# Altium project SmartChessBoard.PrjPcb
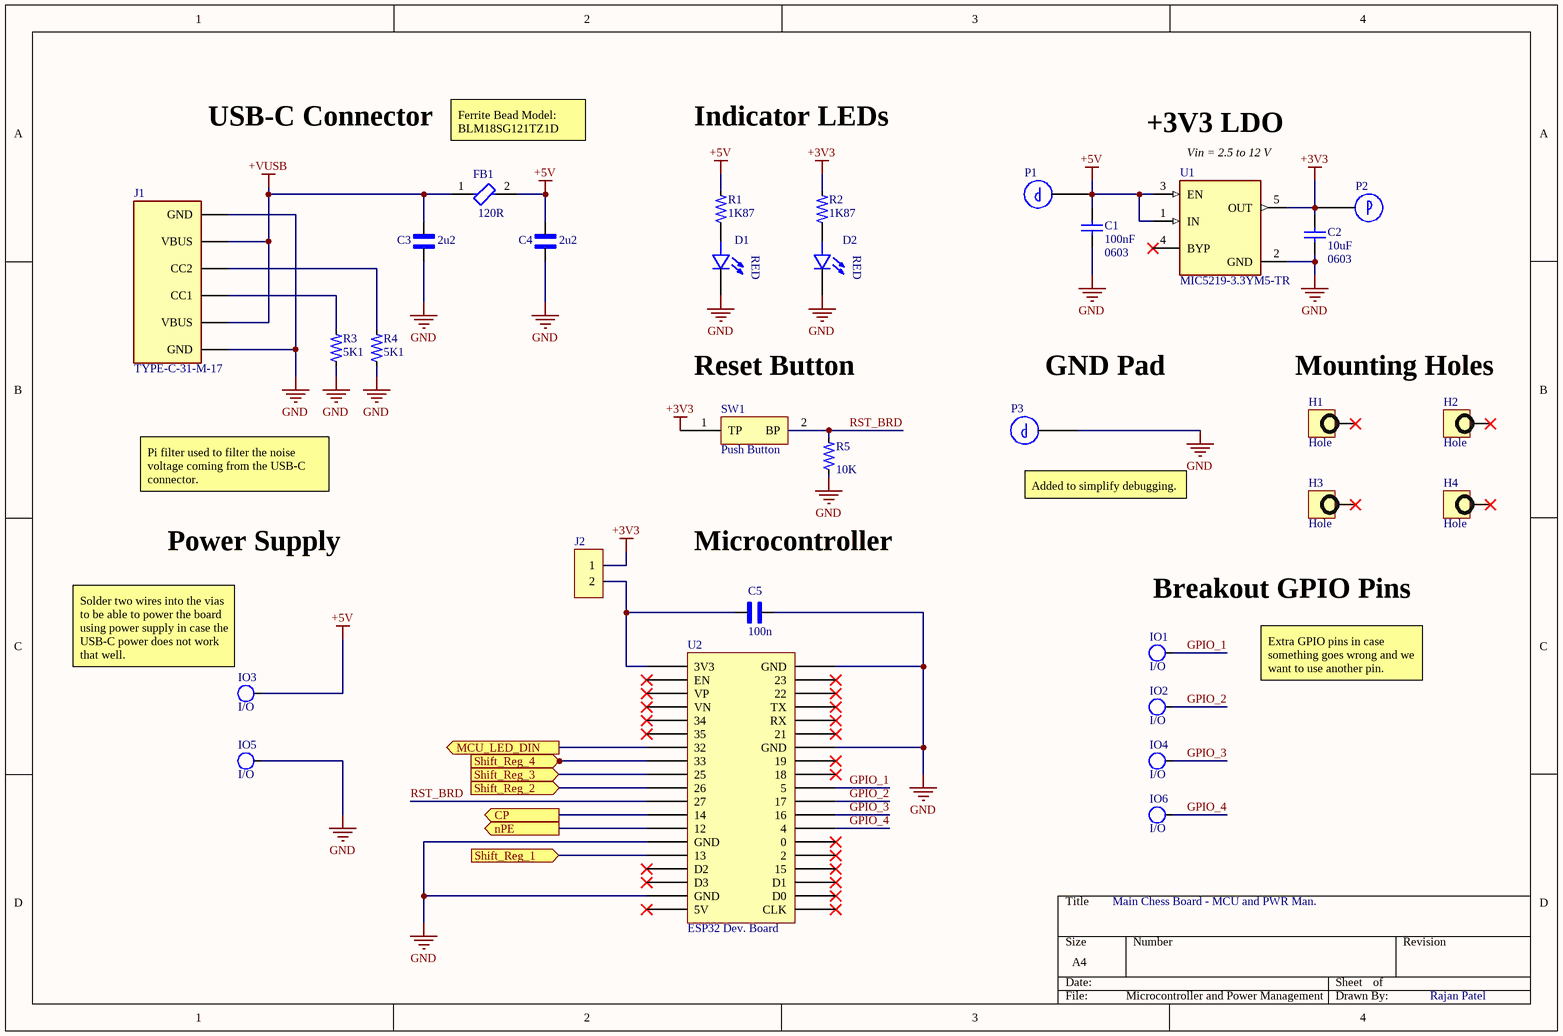
[diagram p0: Microcontroller and Power Management.SchDoc]
4 sheets, 305 parts. Net scope: flat (ports and power ports of the same name join across sheets).
Board file: Chess Board PCB.PcbDoc
Sheets:
  Microcontroller and Power Management.SchDoc
  Reed Switches.SchDoc
  WS2812B.SchDoc
  Shift Registers.SchDoc

## Sheet Microcontroller and Power Management.SchDoc
size A4; SheetNumber: 1; SheetTotal: 4

### Parts
C1  100nF  value 0603  [CAP 0805]
C2  10uF  value 0603  [CAP 0805]
C3  2u2  [CAP 0805]
C4  2u2  [CAP 0805]
C5  100n  [CAP 0805]
D1  LED 0805  [LED_0805]  (value not drawn)
D2  LED 0805  [LED_0805]  (value not drawn)
FB1  120R  [FP-BLM21-0_2-t0_85-e0_5-IPC_A]
H1  Hole  [M3 Holes]
H2  Hole  [M3 Holes]
H3  Hole  [M3 Holes]
H4  Hole  [M3 Holes]
IO1  I/O  [I/O]
IO2  I/O  [I/O]
IO3  I/O  [I/O]
IO4  I/O  [I/O]
IO5  I/O  [I/O]
IO6  I/O  [I/O]
J1  TYPE-C-31-M-17  [TYPEC31M17]
J2  2 Pin Male Header  [2 Pin Male Header]  (value not drawn)
P1  Probe_5019  [Testpoint]  (value not drawn)
P2  Probe_5019  [Testpoint]  (value not drawn)
P3  Probe_5019  [Testpoint]  (value not drawn)
R1  1K87  [res 0805]
R2  1K87  [res 0805]
R3  5K1  [res 0805]
R4  5K1  [res 0805]
R5  10K  [res 0805]
SW1  Push Button  [Push Button]
U1  MIC5219-3.3YM5-TR  [FP-SOT23-5LD-PL-1-IPC_C]
U2  ESP32 Dev. Board  [ESPRESSIF_ESP32-DEVKITC-32UE]

### Ports
CP (out, see Shift Registers[1A]), MCU_LED_DIN (out, see WS2812B[1B]), nPE (out, see Shift Registers[1A]), Shift_Reg_1 (in, see Shift Registers[2B]), Shift_Reg_2 (in, see Shift Registers[4B]), Shift_Reg_3 (in, see Shift Registers[2C]), Shift_Reg_4 (in, see Shift Registers[4C])

### Nets
+3V3: C2.2 J2.1 P2.1 R2.2 SW1.1(TP) U1.5(OUT)
+5V: C1.2 C4.2 FB1.2 IO3.1 P1.1 R1.2 U1.1(IN) U1.3(EN)
+VUSB: C3.2 FB1.1 J1.2(VBUS) J1.5(VBUS)
GND: C1.1 C2.1 C3.1 C4.1 C5.1 D1.1(C) D2.1(C) IO5.1 J1.1(GND) J1.6(GND) P3.1 R3.1 R4.1 R5.1 U1.2(GND) U2.14(GND) U2.18(GND) U2.32(GND) U2.38(GND)
CP: U2.12(14) ; port CP
GPIO_1: IO1.1 U2.29(5)
GPIO_2: IO2.1 U2.28(17)
GPIO_3: IO4.1 U2.27(16)
GPIO_4: IO6.1 U2.26(4)
nPE: U2.13(12) ; port nPE
RST_BRD: R5.2 SW1.2(BP) U2.11(27)
NetC5_2: C5.2 J2.2 U2.1(3V3)
NetD1_2: D1.2(A) R1.1
NetD2_2: D2.2(A) R2.1
NetJ1_3: J1.3(CC1) R3.2
NetJ1_4: J1.4(CC2) R4.2
NetU2_7: U2.7(32) ; port MCU_LED_DIN
NetU2_8: U2.8(33) ; port Shift_Reg_4
NetU2_9: U2.9(25) ; port Shift_Reg_3
NetU2_10: U2.10(26) ; port Shift_Reg_2
NetU2_15: U2.15(13) ; port Shift_Reg_1

Not connected (* = marked no-connect by the designer): H1 1(TERMINAL)*; H2 1(TERMINAL)*; H3 1(TERMINAL)*; H4 1(TERMINAL)*; U1 4(BYP)*; U2 2(EN)* 3(VP)* 4(VN)* 5(34)* 6(35)* 16(D2)* 17(D3)* 19(5V)* 20(CLK)* 21(D0)* 22(D1)* 23(15)* 24(2)* 25(0)* 30(18)* 31(19)* 33(21)* 34(RX)* 35(TX)* 36(22)* 37(23)*

### Notes on the sheet
- USB-C Connector
- Ferrite Bead Model: BLM18SG121TZ1D
- Indicator LEDs
- +3V3 LDO
- (near U1) Vin = 2.5 to 12 V
- Reset Button
- (near P3) GND Pad
- Mounting Holes
- Pi filter used to filter the noise voltage coming from the USB-C connector.
- (near P3) Added to simplify debugging.
- Power Supply
- Microcontroller
- Breakout GPIO Pins
- (near IO3) Solder two wires into the vias to be able to power the board using power supply in case the USB-C power does not work that well.
- Extra GPIO pins in case something goes wrong and we want to use another pin.
- Main Chess Board - MCU and PWR Man.
- Rajan Patel
- (in symbol LED 0805) RED

### Library data of the parts
C1 C2 = Cap: Capacitor; Published: 8-Jun-2000; LatestRevisionDate: 17-Jul-2002; LatestRevisionNote: Re-released for DXP Platform.; PackageReference: RAD-0.3; Publisher: Altium Limited; PackageDescription: Radial Cap, Thru-Hole; 2 Leads; 0.3 in Pin Spacing
C3-C5 = CAP 0805: SnapEDA_Link: https://www.snapeda.com/parts/C2012X8R1H104K125AA/TDK/view-part/?ref=snap; Check_prices: https://www.snapeda.com/parts/C2012X8R1H104K125AA/TDK/view-part/?ref=eda; Value: *
D1 D2 = LED 0805: Red LED Indication - Discrete 1.7V 0805 (2012 Metric); MP: 7012X1; Package: None; Availability: Unavailable; Value: *; Price: None
FB1 = CMP-0686-00716-3: FERRITE BEAD 120 OHM 0603 1LN; Number of Lines: 1; DC Resistance-Max: 100mR; Material: Steel; Max DC Current: 200mA; Shielding: Unshielded; Test Frequency: 100MHz; Current Rating: 800mA; Max Current Rating: 1A; Resistance: 150mR; Tolerance: 25%; Width: 1.25mm; Number of Circuits: 1; Military Standard: Not; Height: 0.85mm; Series: BLM21A; Min Operating Temperature: -55°C; DC Resistance (DCR): 100mR; Termination: SMD/SMT; Impedance: 120R; Core Material: Ferrite; REACH SVHC: No SVHC; Radiation Hardening: No; Max Operating Temperature: 125°C; Number of Pins: 2; Case/Package: 0805; Case Code (Imperial): 0805; Frequency: 100MHz; Depth: 1.25mm; Length: 2mm; DC Current: 200mA; Lead Free: Lead Free; Case Code (Metric): 2012; Package Quantity: 1; Packaging: Tape and Reel
J1 = TYPE-C-31-M-17: TYPE-C-31-M-17 HROPARTS; MF: HRO Electronics Co., Ltd.; SnapEDA_Link: https://www.snapeda.com/parts/TYPE-C-31-M-17/HRO+Electronics+Co.%252C+Ltd./view-part/?ref=snap; Package: Package; Value: *; MP: TYPE-C-31-M-17; Check_prices: https://www.snapeda.com/parts/TYPE-C-31-M-17/HRO+Electronics+Co.%252C+Ltd./view-part/?ref=eda
J2 = 2 Pin Male Header: Board Connector, 2 Contact(s), 1 Row(s), Male, Straight, 0.1 inch Pitch, Solder Terminal, Black Insulator, Receptacle; Manufacturer: TE Connectivity; Manufacturer Part Number: 5-146277-2; Option: General Purpose; Contact Pattern: RECTANGULAR; Contact Style: SQ PIN-SKT; Filter Feature: No; Number Of Connectors: 1; Number of Contacts: 2; Body Breadth: 0.092inch; Body Depth: 0.09inch; Body Length: 0.184inch; Plating Thickness: 30uin; Reference Standard: UL; Reliability: COMMERCIAL; Supplier: Digikey; Supplier Part Number: A121371-ND; RoHS: Yes; Category: Connectors; Stock: 17660; Pricing: 1=0.41, 10=0.372, 100=0.3099, 500=0.2634, 1000=0.23087, 5000=0.20608, 10000=0.19176 (USD); Mounting Technology: Board; Contact Finish - Mating: MATTE TIN; Contact Finish - Termination: MATTE TIN; Insulation Color: Black; Insulation Material: Polymer; Connector Type: BOARD CONNECTOR; JESD-609 Code: e3; Body/Shell Style: RECEPTACLE; Contact Gender: Male; Mixed Contacts: No; Mounting Style: STRAIGHT; Number Of PCB Rows: 1; Number of Rows Loaded: 1; PCB Contact Pattern: RECTANGULAR; Termination: Solder; Mating Contact Pitch: 0.1inch; Terminal Length: 0.125inch; Terminal Pitch: 2.54mm; DIN Conformance: No; IEC Conformance: No; MIL Conformance: No; Reach SVHC Compliant: Yes; RoHS Compliant: Yes; ComponentLink1URL: https://datasheet.ciiva.com:443/pdfs/VipMasterIC/IC/TYEL/TYEL-L-A0003497673/TYEL-S-A0000657051-1.pdf?src-supplier=IHS+Markit; ComponentLink1Description: https://datasheet.ciiva.com:443/pdfs/VipMasterIC/IC/TYEL/TYEL-L-A0003497673/TYEL-S-A0000657051-1.pdf?src-supplier=IHS+Markit; ComponentLink2URL: https://datasheet.ciiva.com/22660/1537112-22660377.pdf?src-supplier=Element14; ComponentLink2Description: https://datasheet.ciiva.com/22660/1537112-22660377.pdf?src-supplier=Element14; ComponentLink3URL: https://datasheet.ciiva.com/717/eng-cd-146277-h-146277-1-c-dwg-717333.pdf?src-supplier=Digikey; ComponentLink3Description: https://datasheet.ciiva.com/717/eng-cd-146277-h-146277-1-c-dwg-717333.pdf?src-supplier=Digikey; ComponentLink4URL: https://datasheet.ciiva.com/16426/eng-cd-146277-g2-16426389.pdf?src-supplier=Future+Electronics; ComponentLink4Description: https://datasheet.ciiva.com/16426/eng-cd-146277-g2-16426389.pdf?src-supplier=Future+Electronics; ComponentLink5URL: https://datasheet.ciiva.com/30096/146277-30096236.pdf?src-supplier=Onlinecomponents.com; ComponentLink5Description: https://datasheet.ciiva.com/30096/146277-30096236.pdf?src-supplier=Onlinecomponents.com
P1-P3 = Probe_5019: Phosphor Bronze Contact Miniature Silver Plated Surface Mount Test Points; Manufacturer: Keystone Electronics; Manufacturer Part Number: 5019; Supplier 1: Newark; RoHS: Yes; Category: Connectors; Stock 1: 148000; Pricing 1: 1=0.12300, 1000=0.12300, 2000=0.11700, 4000=0.11300, 6000=0.11000 (USD); Mount: Surface Mount,PCB; Number of Pins: 1; Contact Plating: Silver; Contact Material: Bronze; Material: Bronze; Plating: Silver; Body Material: Bronze; Packaging: Tape and Reel; Package Quantity: 1; Termination: SMD/SMT; Series: 5019; Height: 0.09inch; RoHS Compliant: Yes; Lead Free: Lead Free; Reach SVHC Compliant: Yes; ComponentLink1URL: https://datasheet.ciiva.com/16318/m60-2p61-16318395.pdf?src-supplier=Future+Electronics; ComponentLink1Description: https://datasheet.ciiva.com/16318/m60-2p61-16318395.pdf?src-supplier=Future+Electronics; ComponentLink2URL: https://datasheet.ciiva.com/16885/70182998-16885945.pdf?src-supplier=Allied+Electronics; ComponentLink2Description: https://datasheet.ciiva.com/16885/70182998-16885945.pdf?src-supplier=Allied+Electronics; ComponentLink3URL: https://datasheet.ciiva.com/14848/m60-2p61-14848437.pdf?src-supplier=Digi-Key; ComponentLink3Description: https://datasheet.ciiva.com/14848/m60-2p61-14848437.pdf?src-supplier=Digi-Key; ComponentLink4URL: https://datasheet.ciiva.com/14848/m60-2p61-14848438.pdf?src-supplier=Digi-Key; ComponentLink4Description: https://datasheet.ciiva.com/14848/m60-2p61-14848438.pdf?src-supplier=Digi-Key; ComponentLink5URL: https://datasheet.ciiva.com/14848/m60-2p61-14848439.pdf?src-supplier=Digi-Key; ComponentLink5Description: https://datasheet.ciiva.com/14848/m60-2p61-14848439.pdf?src-supplier=Digi-Key; Supplier Part Number 1: 06W4636
R1-R5 = Resistor 0805: MP: 2-2176053-2; Resistance: .39; Power_Rating: .25 W; MF: TE Connectivity; Tolerance: 1%; Package: 0805; Value: *; SnapEDA_Link: https://www.snapeda.com/parts/2-2176053-2/TE%20Connectivity/view-part/2214511/?ref=snap; Availability: Unavailable; Price: None; EU_RoHS_Compliance: Compliant with Exemptions
U1 = CMP-06324-000027-1: IC REG LINEAR 3.3V 500MA SOT23-5; Dropout Voltage: 350mV; Output Type: Fixed; Number of Regulators: 1; Max Input Voltage: 12V; Min Input Voltage: 2.5V; Min Operating Temperature: -40°C; Nominal Output Voltage: 3.3V; Output Voltage: 3.3V; Packaging: Cut Tape; Mount: Surface Mount; Number of Pins: 5; Case/Package: SOT-23-5; Lead Free: Lead Free; Max Operating Temperature: 125°C; REACH SVHC: No SVHC; Output Current: 500mA
U2 = ESP32 Dev. Board: ESP32-WROOM-32UE Series Evaluation Board 802.11 b/g/n (WiFi, WLAN) Bluetooth Smart Ready 4.x Dual Mode; Manufacturer: Espressif Systems; Manufacturer Part Number: ESP32-DEVKITC-32UE; Supplier: Digikey; Supplier Part Number: 1965-ESP32-DEVKITC-32UE-ND; RoHS: No; Category: RF Semiconductors and Devices; Stock: 498; Pricing: 1=10 (USD); ComponentLink1URL: https://www.espressif.com/sites/default/files/documentation/espressif_products_ordering_information_en.pdf?src-supplier=Digikey; ComponentLink1Description: https://www.espressif.com/sites/default/files/documentation/espressif_products_ordering_information_en.pdf?src-supplier=Digikey; ComponentLink2URL: https://datasheet.octopart.com/ESP32-DEVKITC-32UE-Espressif-Systems-datasheet-165560559.pdf?src-supplier=TME; ComponentLink2Description: https://datasheet.octopart.com/ESP32-DEVKITC-32UE-Espressif-Systems-datasheet-165560559.pdf?src-supplier=TME

## Sheet Reed Switches.SchDoc
size A2; SheetNumber: 2; SheetTotal: 4
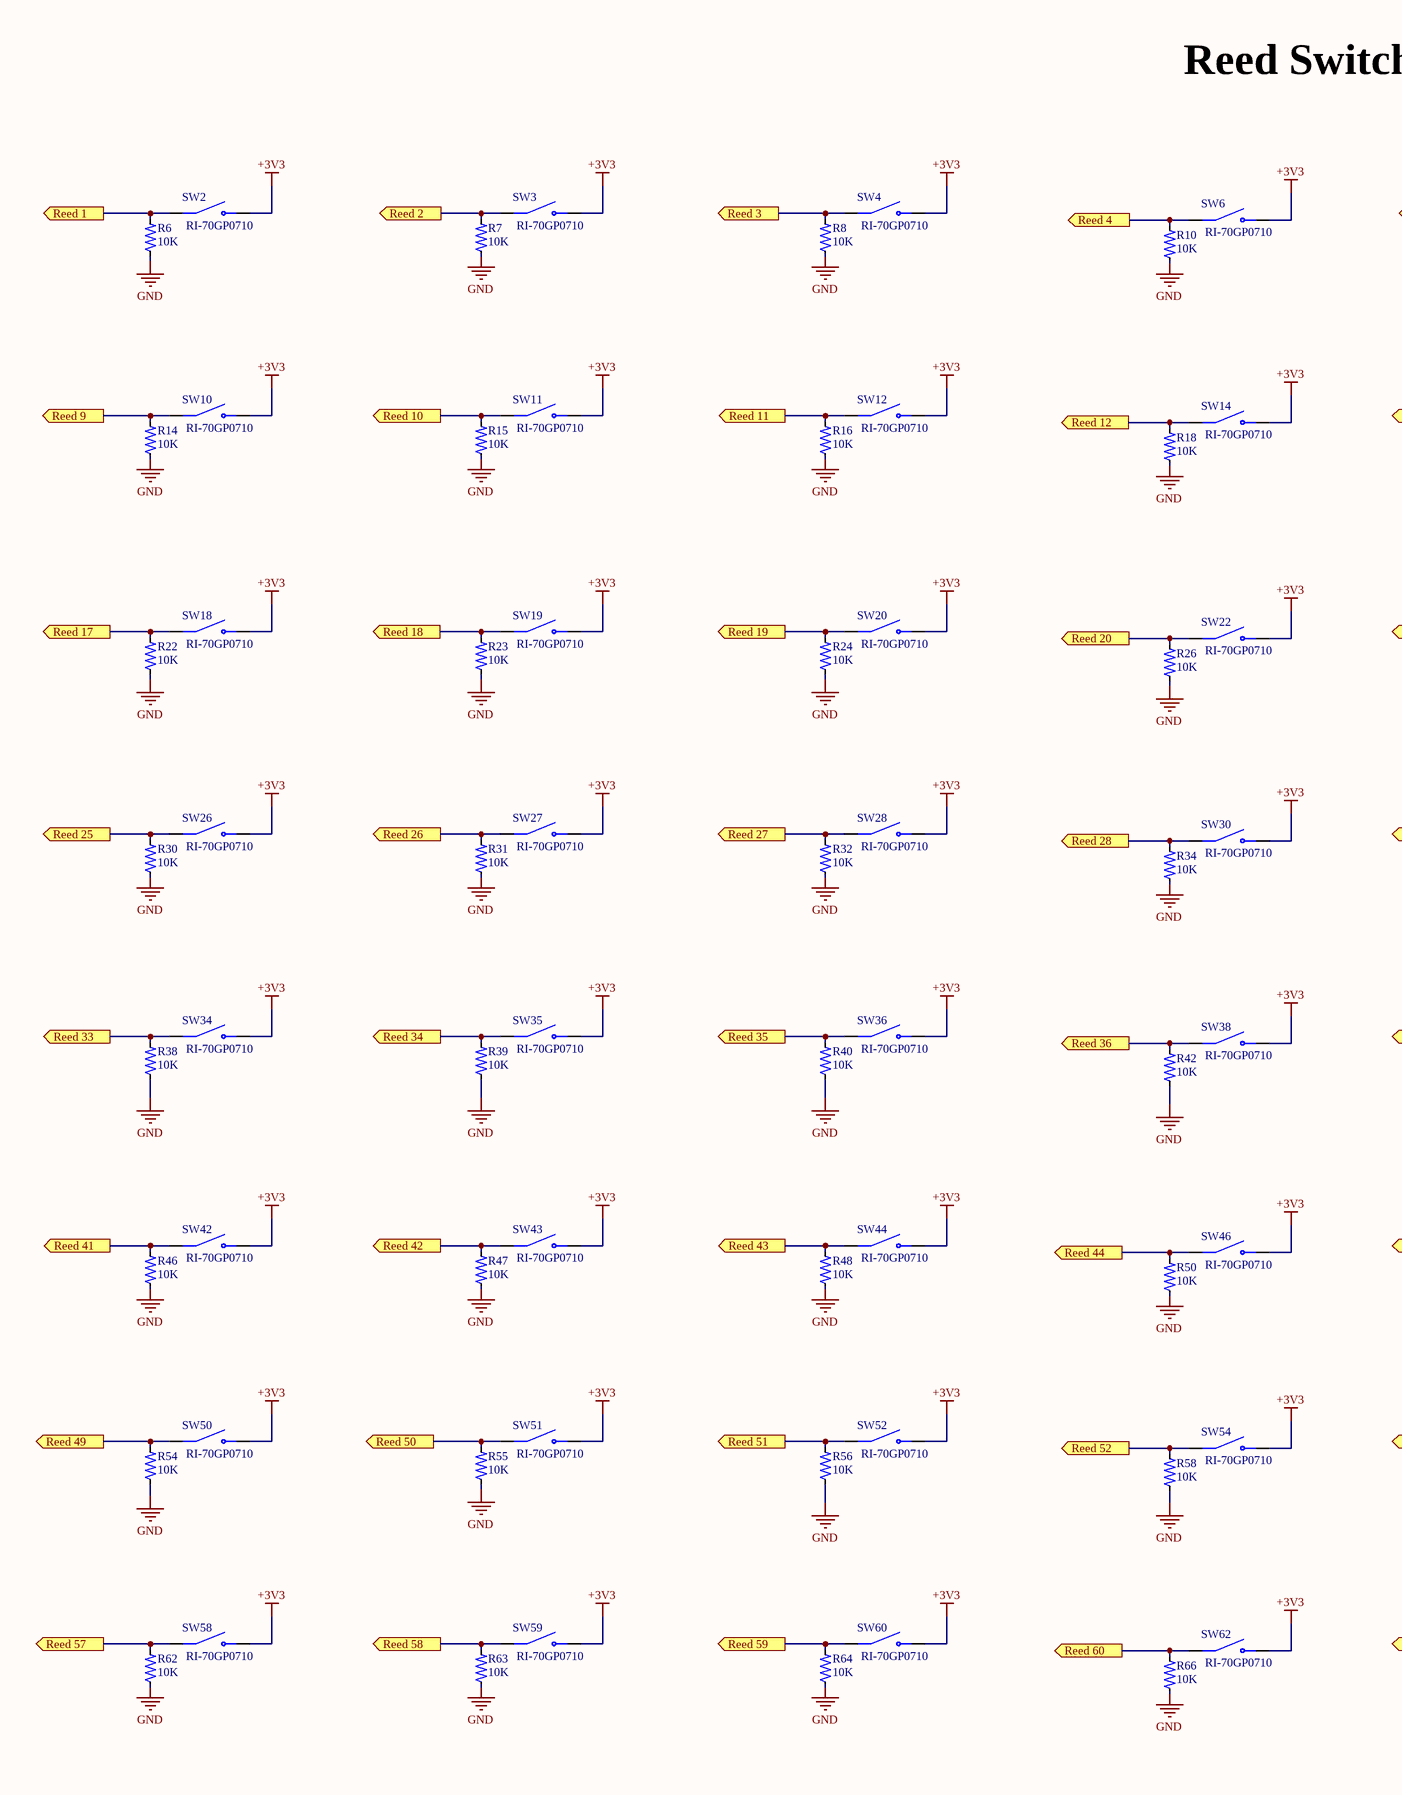
[diagram p1: Reed Switches.SchDoc, left]
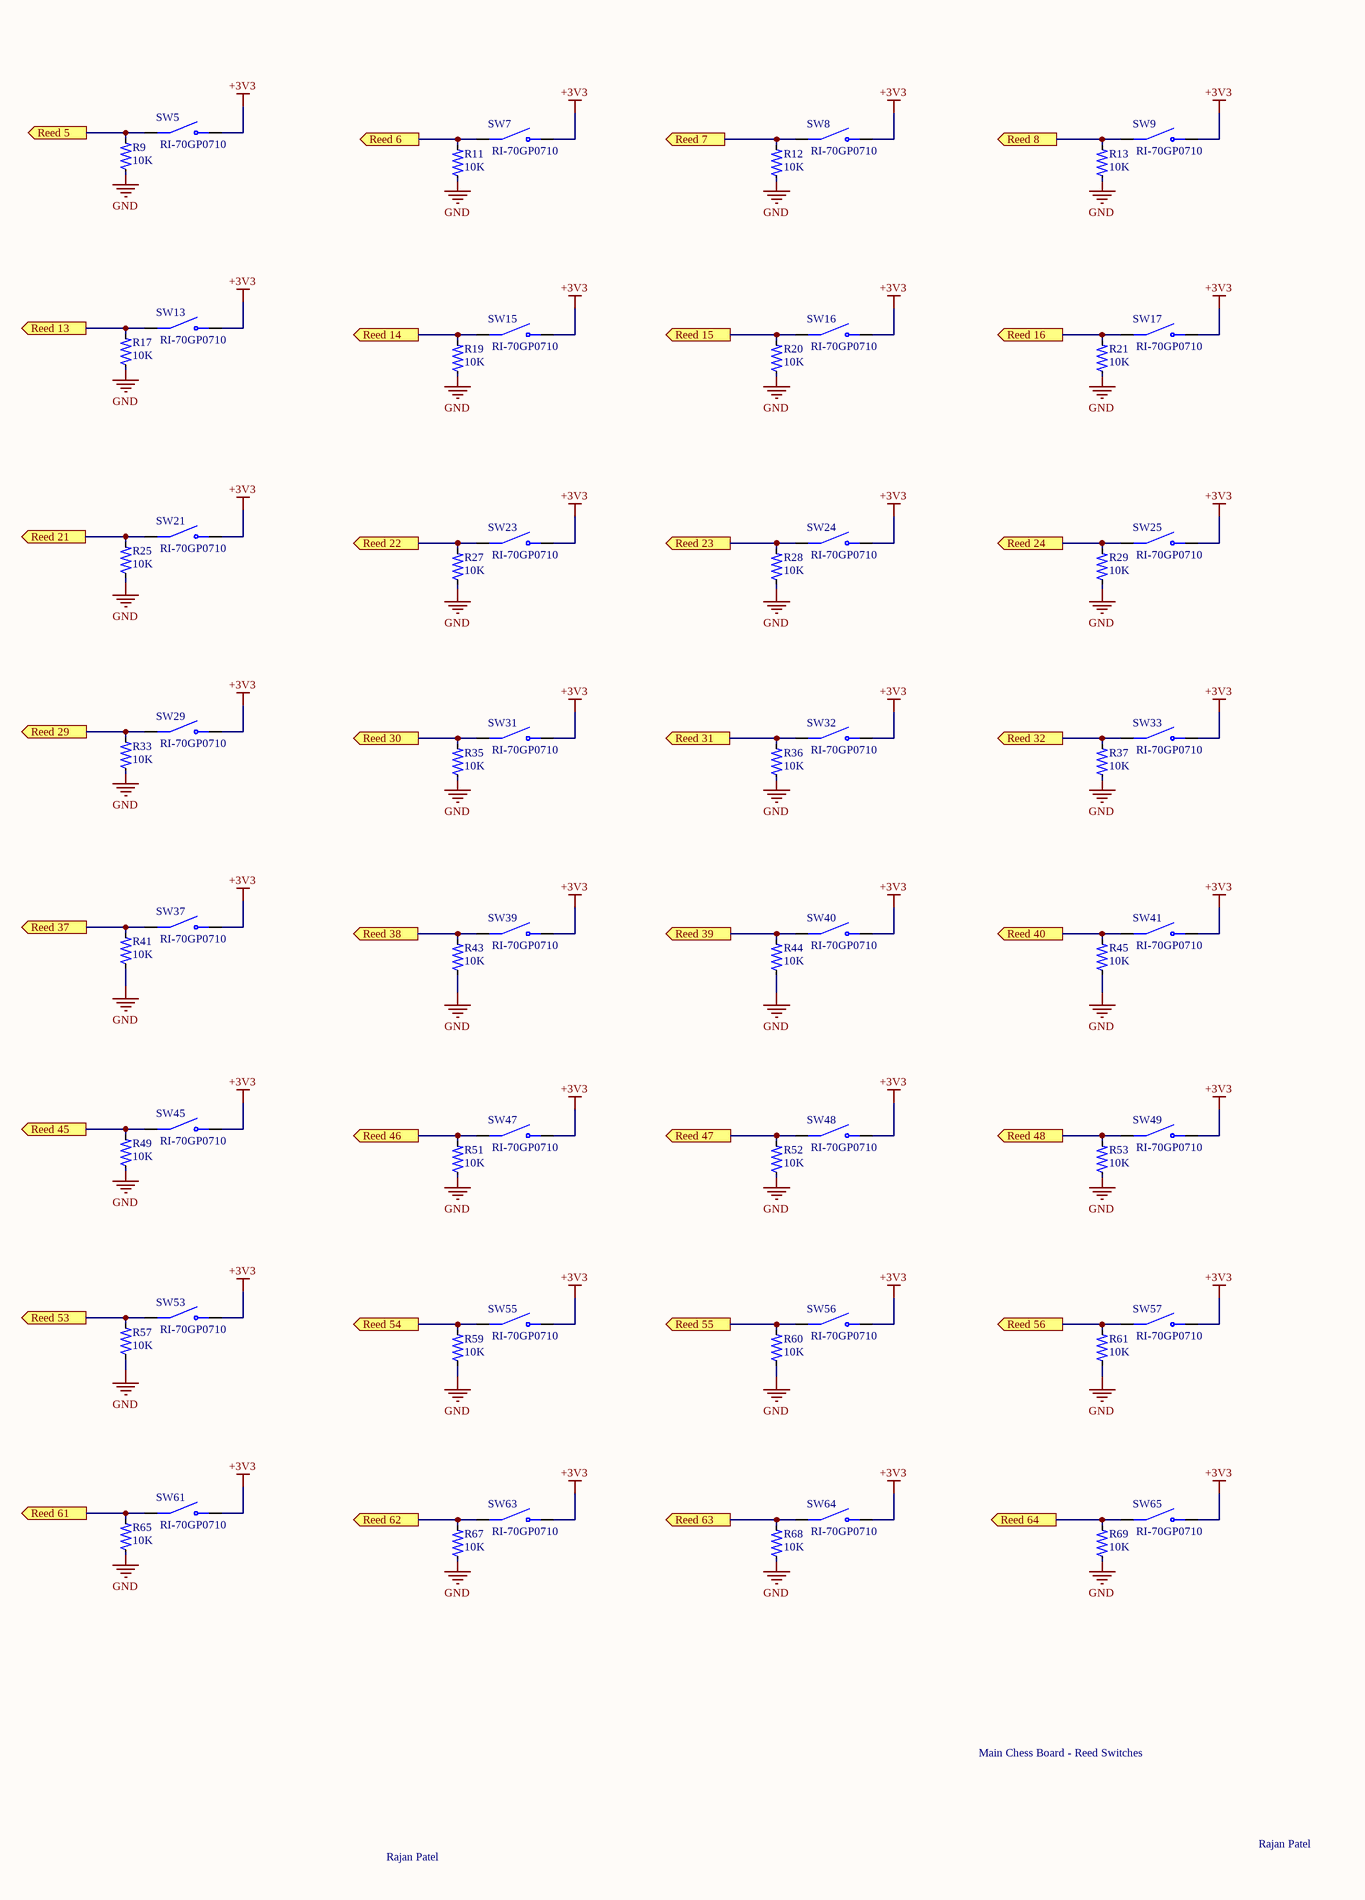
[diagram p2: Reed Switches.SchDoc, right]

### Parts
R6  10K  [res 0805]
R7  10K  [res 0805]
R8  10K  [res 0805]
R9  10K  [res 0805]
R10  10K  [res 0805]
R11  10K  [res 0805]
R12  10K  [res 0805]
R13  10K  [res 0805]
R14  10K  [res 0805]
R15  10K  [res 0805]
R16  10K  [res 0805]
R17  10K  [res 0805]
R18  10K  [res 0805]
R19  10K  [res 0805]
R20  10K  [res 0805]
R21  10K  [res 0805]
R22  10K  [res 0805]
R23  10K  [res 0805]
R24  10K  [res 0805]
R25  10K  [res 0805]
R26  10K  [res 0805]
R27  10K  [res 0805]
R28  10K  [res 0805]
R29  10K  [res 0805]
R30  10K  [res 0805]
R31  10K  [res 0805]
R32  10K  [res 0805]
R33  10K  [res 0805]
R34  10K  [res 0805]
R35  10K  [res 0805]
R36  10K  [res 0805]
R37  10K  [res 0805]
R38  10K  [res 0805]
R39  10K  [res 0805]
R40  10K  [res 0805]
R41  10K  [res 0805]
R42  10K  [res 0805]
R43  10K  [res 0805]
R44  10K  [res 0805]
R45  10K  [res 0805]
R46  10K  [res 0805]
R47  10K  [res 0805]
R48  10K  [res 0805]
R49  10K  [res 0805]
R50  10K  [res 0805]
R51  10K  [res 0805]
R52  10K  [res 0805]
R53  10K  [res 0805]
R54  10K  [res 0805]
R55  10K  [res 0805]
R56  10K  [res 0805]
R57  10K  [res 0805]
R58  10K  [res 0805]
R59  10K  [res 0805]
R60  10K  [res 0805]
R61  10K  [res 0805]
R62  10K  [res 0805]
R63  10K  [res 0805]
R64  10K  [res 0805]
R65  10K  [res 0805]
R66  10K  [res 0805]
R67  10K  [res 0805]
R68  10K  [res 0805]
R69  10K  [res 0805]
SW2  RI-70GP0710  [RI-70GP0710]
SW3  RI-70GP0710  [RI-70GP0710]
SW4  RI-70GP0710  [RI-70GP0710]
SW5  RI-70GP0710  [RI-70GP0710]
SW6  RI-70GP0710  [RI-70GP0710]
SW7  RI-70GP0710  [RI-70GP0710]
SW8  RI-70GP0710  [RI-70GP0710]
SW9  RI-70GP0710  [RI-70GP0710]
SW10  RI-70GP0710  [RI-70GP0710]
SW11  RI-70GP0710  [RI-70GP0710]
SW12  RI-70GP0710  [RI-70GP0710]
SW13  RI-70GP0710  [RI-70GP0710]
SW14  RI-70GP0710  [RI-70GP0710]
SW15  RI-70GP0710  [RI-70GP0710]
SW16  RI-70GP0710  [RI-70GP0710]
SW17  RI-70GP0710  [RI-70GP0710]
SW18  RI-70GP0710  [RI-70GP0710]
SW19  RI-70GP0710  [RI-70GP0710]
SW20  RI-70GP0710  [RI-70GP0710]
SW21  RI-70GP0710  [RI-70GP0710]
SW22  RI-70GP0710  [RI-70GP0710]
SW23  RI-70GP0710  [RI-70GP0710]
SW24  RI-70GP0710  [RI-70GP0710]
SW25  RI-70GP0710  [RI-70GP0710]
SW26  RI-70GP0710  [RI-70GP0710]
SW27  RI-70GP0710  [RI-70GP0710]
SW28  RI-70GP0710  [RI-70GP0710]
SW29  RI-70GP0710  [RI-70GP0710]
SW30  RI-70GP0710  [RI-70GP0710]
SW31  RI-70GP0710  [RI-70GP0710]
SW32  RI-70GP0710  [RI-70GP0710]
SW33  RI-70GP0710  [RI-70GP0710]
SW34  RI-70GP0710  [RI-70GP0710]
SW35  RI-70GP0710  [RI-70GP0710]
SW36  RI-70GP0710  [RI-70GP0710]
SW37  RI-70GP0710  [RI-70GP0710]
SW38  RI-70GP0710  [RI-70GP0710]
SW39  RI-70GP0710  [RI-70GP0710]
SW40  RI-70GP0710  [RI-70GP0710]
SW41  RI-70GP0710  [RI-70GP0710]
SW42  RI-70GP0710  [RI-70GP0710]
SW43  RI-70GP0710  [RI-70GP0710]
SW44  RI-70GP0710  [RI-70GP0710]
SW45  RI-70GP0710  [RI-70GP0710]
SW46  RI-70GP0710  [RI-70GP0710]
SW47  RI-70GP0710  [RI-70GP0710]
SW48  RI-70GP0710  [RI-70GP0710]
SW49  RI-70GP0710  [RI-70GP0710]
SW50  RI-70GP0710  [RI-70GP0710]
SW51  RI-70GP0710  [RI-70GP0710]
SW52  RI-70GP0710  [RI-70GP0710]
SW53  RI-70GP0710  [RI-70GP0710]
SW54  RI-70GP0710  [RI-70GP0710]
SW55  RI-70GP0710  [RI-70GP0710]
SW56  RI-70GP0710  [RI-70GP0710]
SW57  RI-70GP0710  [RI-70GP0710]
SW58  RI-70GP0710  [RI-70GP0710]
SW59  RI-70GP0710  [RI-70GP0710]
SW60  RI-70GP0710  [RI-70GP0710]
SW61  RI-70GP0710  [RI-70GP0710]
SW62  RI-70GP0710  [RI-70GP0710]
SW63  RI-70GP0710  [RI-70GP0710]
SW64  RI-70GP0710  [RI-70GP0710]
SW65  RI-70GP0710  [RI-70GP0710]

### Ports
Reed 1 (out, see Shift Registers[2B]), Reed 2 (out, see Shift Registers[2B]), Reed 3 (out, see Shift Registers[2B]), Reed 4 (out, see Shift Registers[2B]), Reed 5 (out, see Shift Registers[2B]), Reed 6 (out, see Shift Registers[2B]), Reed 7 (out, see Shift Registers[2B]), Reed 8 (out, see Shift Registers[2B]), Reed 9 (out, see Shift Registers[1B]), Reed 10 (out, see Shift Registers[1B]), Reed 11 (out, see Shift Registers[1B]), Reed 12 (out, see Shift Registers[1B]), Reed 13 (out, see Shift Registers[1B]), Reed 14 (out, see Shift Registers[1B]), Reed 15 (out, see Shift Registers[1B]), Reed 16 (out, see Shift Registers[1B]), Reed 17 (out, see Shift Registers[4B]), Reed 18 (out, see Shift Registers[4B]), Reed 19 (out, see Shift Registers[4B]), Reed 20 (out, see Shift Registers[4B]), Reed 21 (out, see Shift Registers[4B]), Reed 22 (out, see Shift Registers[4B]), Reed 23 (out, see Shift Registers[4B]), Reed 24 (out, see Shift Registers[4B]), Reed 25 (out, see Shift Registers[3B]), Reed 26 (out, see Shift Registers[3B]), Reed 27 (out, see Shift Registers[3B]), Reed 28 (out, see Shift Registers[3B]), Reed 29 (out, see Shift Registers[3B]), Reed 30 (out, see Shift Registers[3B]), Reed 31 (out, see Shift Registers[3B]), Reed 32 (out, see Shift Registers[3B]), Reed 33 (out, see Shift Registers[2C]), Reed 34 (out, see Shift Registers[2C]), Reed 35 (out, see Shift Registers[2C]), Reed 36 (out, see Shift Registers[2C]), Reed 37 (out, see Shift Registers[2C]), Reed 38 (out, see Shift Registers[2C]), Reed 39 (out, see Shift Registers[2C]), Reed 40 (out, see Shift Registers[2C]), Reed 41 (out, see Shift Registers[1C]), Reed 42 (out, see Shift Registers[1C]), Reed 43 (out, see Shift Registers[1C]), Reed 44 (out, see Shift Registers[1C]), Reed 45 (out, see Shift Registers[1C]), Reed 46 (out, see Shift Registers[1C]), Reed 47 (out, see Shift Registers[1C]), Reed 48 (out, see Shift Registers[1C]), Reed 49 (out, see Shift Registers[4C]), Reed 50 (out, see Shift Registers[4C]), Reed 51 (out, see Shift Registers[4C]), Reed 52 (out, see Shift Registers[4C]), Reed 53 (out, see Shift Registers[4C]), Reed 54 (out, see Shift Registers[4C]), Reed 55 (out, see Shift Registers[4C]), Reed 56 (out, see Shift Registers[4C]), Reed 57 (out, see Shift Registers[3C]), Reed 58 (out, see Shift Registers[3C]), Reed 59 (out, see Shift Registers[3C]), Reed 60 (out, see Shift Registers[3C]), Reed 61 (out, see Shift Registers[3C]), Reed 62 (out, see Shift Registers[3C]), Reed 63 (out, see Shift Registers[3C]), Reed 64 (out, see Shift Registers[3C])

### Nets
+3V3: SW2.2(NO) SW3.2(NO) SW4.2(NO) SW5.2(NO) SW6.2(NO) SW7.2(NO) SW8.2(NO) SW9.2(NO) SW10.2(NO) SW11.2(NO) SW12.2(NO) SW13.2(NO) SW14.2(NO) SW15.2(NO) SW16.2(NO) SW17.2(NO) SW18.2(NO) SW19.2(NO) SW20.2(NO) SW21.2(NO) SW22.2(NO) SW23.2(NO) SW24.2(NO) SW25.2(NO) SW26.2(NO) SW27.2(NO) SW28.2(NO) SW29.2(NO) SW30.2(NO) SW31.2(NO) SW32.2(NO) SW33.2(NO) SW34.2(NO) SW35.2(NO) SW36.2(NO) SW37.2(NO) SW38.2(NO) SW39.2(NO) SW40.2(NO) SW41.2(NO) SW42.2(NO) SW43.2(NO) SW44.2(NO) SW45.2(NO) SW46.2(NO) SW47.2(NO) SW48.2(NO) SW49.2(NO) SW50.2(NO) SW51.2(NO) SW52.2(NO) SW53.2(NO) SW54.2(NO) SW55.2(NO) SW56.2(NO) SW57.2(NO) SW58.2(NO) SW59.2(NO) SW60.2(NO) SW61.2(NO) SW62.2(NO) SW63.2(NO) SW64.2(NO) SW65.2(NO)
GND: R6.1 R7.1 R8.1 R9.1 R10.1 R11.1 R12.1 R13.1 R14.1 R15.1 R16.1 R17.1 R18.1 R19.1 R20.1 R21.1 R22.1 R23.1 R24.1 R25.1 R26.1 R27.1 R28.1 R29.1 R30.1 R31.1 R32.1 R33.1 R34.1 R35.1 R36.1 R37.1 R38.1 R39.1 R40.1 R41.1 R42.1 R43.1 R44.1 R45.1 R46.1 R47.1 R48.1 R49.1 R50.1 R51.1 R52.1 R53.1 R54.1 R55.1 R56.1 R57.1 R58.1 R59.1 R60.1 R61.1 R62.1 R63.1 R64.1 R65.1 R66.1 R67.1 R68.1 R69.1
NetR6_2: R6.2 SW2.1(COM) ; port Reed 1
NetR7_2: R7.2 SW3.1(COM) ; port Reed 2
NetR8_2: R8.2 SW4.1(COM) ; port Reed 3
NetR9_2: R9.2 SW5.1(COM) ; port Reed 5
NetR10_2: R10.2 SW6.1(COM) ; port Reed 4
NetR11_2: R11.2 SW7.1(COM) ; port Reed 6
NetR12_2: R12.2 SW8.1(COM) ; port Reed 7
NetR13_2: R13.2 SW9.1(COM) ; port Reed 8
NetR14_2: R14.2 SW10.1(COM) ; port Reed 9
NetR15_2: R15.2 SW11.1(COM) ; port Reed 10
NetR16_2: R16.2 SW12.1(COM) ; port Reed 11
NetR17_2: R17.2 SW13.1(COM) ; port Reed 13
NetR18_2: R18.2 SW14.1(COM) ; port Reed 12
NetR19_2: R19.2 SW15.1(COM) ; port Reed 14
NetR20_2: R20.2 SW16.1(COM) ; port Reed 15
NetR21_2: R21.2 SW17.1(COM) ; port Reed 16
NetR22_2: R22.2 SW18.1(COM) ; port Reed 17
NetR23_2: R23.2 SW19.1(COM) ; port Reed 18
NetR24_2: R24.2 SW20.1(COM) ; port Reed 19
NetR25_2: R25.2 SW21.1(COM) ; port Reed 21
NetR26_2: R26.2 SW22.1(COM) ; port Reed 20
NetR27_2: R27.2 SW23.1(COM) ; port Reed 22
NetR28_2: R28.2 SW24.1(COM) ; port Reed 23
NetR29_2: R29.2 SW25.1(COM) ; port Reed 24
NetR30_2: R30.2 SW26.1(COM) ; port Reed 25
NetR31_2: R31.2 SW27.1(COM) ; port Reed 26
NetR32_2: R32.2 SW28.1(COM) ; port Reed 27
NetR33_2: R33.2 SW29.1(COM) ; port Reed 29
NetR34_2: R34.2 SW30.1(COM) ; port Reed 28
NetR35_2: R35.2 SW31.1(COM) ; port Reed 30
NetR36_2: R36.2 SW32.1(COM) ; port Reed 31
NetR37_2: R37.2 SW33.1(COM) ; port Reed 32
NetR38_2: R38.2 SW34.1(COM) ; port Reed 33
NetR39_2: R39.2 SW35.1(COM) ; port Reed 34
NetR40_2: R40.2 SW36.1(COM) ; port Reed 35
NetR41_2: R41.2 SW37.1(COM) ; port Reed 37
NetR42_2: R42.2 SW38.1(COM) ; port Reed 36
NetR43_2: R43.2 SW39.1(COM) ; port Reed 38
NetR44_2: R44.2 SW40.1(COM) ; port Reed 39
NetR45_2: R45.2 SW41.1(COM) ; port Reed 40
NetR46_2: R46.2 SW42.1(COM) ; port Reed 41
NetR47_2: R47.2 SW43.1(COM) ; port Reed 42
NetR48_2: R48.2 SW44.1(COM) ; port Reed 43
NetR49_2: R49.2 SW45.1(COM) ; port Reed 45
NetR50_2: R50.2 SW46.1(COM) ; port Reed 44
NetR51_2: R51.2 SW47.1(COM) ; port Reed 46
NetR52_2: R52.2 SW48.1(COM) ; port Reed 47
NetR53_2: R53.2 SW49.1(COM) ; port Reed 48
NetR54_2: R54.2 SW50.1(COM) ; port Reed 49
NetR55_2: R55.2 SW51.1(COM) ; port Reed 50
NetR56_2: R56.2 SW52.1(COM) ; port Reed 51
NetR57_2: R57.2 SW53.1(COM) ; port Reed 53
NetR58_2: R58.2 SW54.1(COM) ; port Reed 52
NetR59_2: R59.2 SW55.1(COM) ; port Reed 54
NetR60_2: R60.2 SW56.1(COM) ; port Reed 55
NetR61_2: R61.2 SW57.1(COM) ; port Reed 56
NetR62_2: R62.2 SW58.1(COM) ; port Reed 57
NetR63_2: R63.2 SW59.1(COM) ; port Reed 58
NetR64_2: R64.2 SW60.1(COM) ; port Reed 59
NetR65_2: R65.2 SW61.1(COM) ; port Reed 61
NetR66_2: R66.2 SW62.1(COM) ; port Reed 60
NetR67_2: R67.2 SW63.1(COM) ; port Reed 62
NetR68_2: R68.2 SW64.1(COM) ; port Reed 63
NetR69_2: R69.2 SW65.1(COM) ; port Reed 64

### Notes on the sheet
- Reed Switches
- Main Chess Board - Reed Switches
- Rajan Patel

### Library data of the parts
R6-R69 = Resistor 0805: as R1 on sheet Microcontroller and Power Management; Package: 0805; Value: *; SnapEDA_Link: https://www.snapeda.com/parts/2-2176053-2/TE%20Connectivity/view-part/2214511/?ref=snap; Availability: Unavailable; Price: None; EU_RoHS_Compliance: Compliant with Exemptions
SW2-SW65 = RI-70GP0710: Switch Reed Spst-no 500MA 120V; Manufacturer: Comus; Supplier: Digikey; Supplier Part Number: 1835-1025-ND; Manufacturer Part Number: RI-70GP0710; RoHS: No; Stock: 52347; Pricing: 1=1.05, 10=1.01, 25=0.9496, 100=0.8201, 250=0.7474, 500=0.69488, 2000=0.6464, 4000=0.5858, 6000=0.5454 (USD); ComponentLink1URL: https://www.comus-intl.com/wp-content/uploads/2018/10/RI-70GP.pdf?src-supplier=Digikey; ComponentLink1Description: https://www.comus-intl.com/wp-content/uploads/2018/10/RI-70GP.pdf?src-supplier=Digikey

## Sheet WS2812B.SchDoc
size A3; SheetNumber: 3; SheetTotal: 4
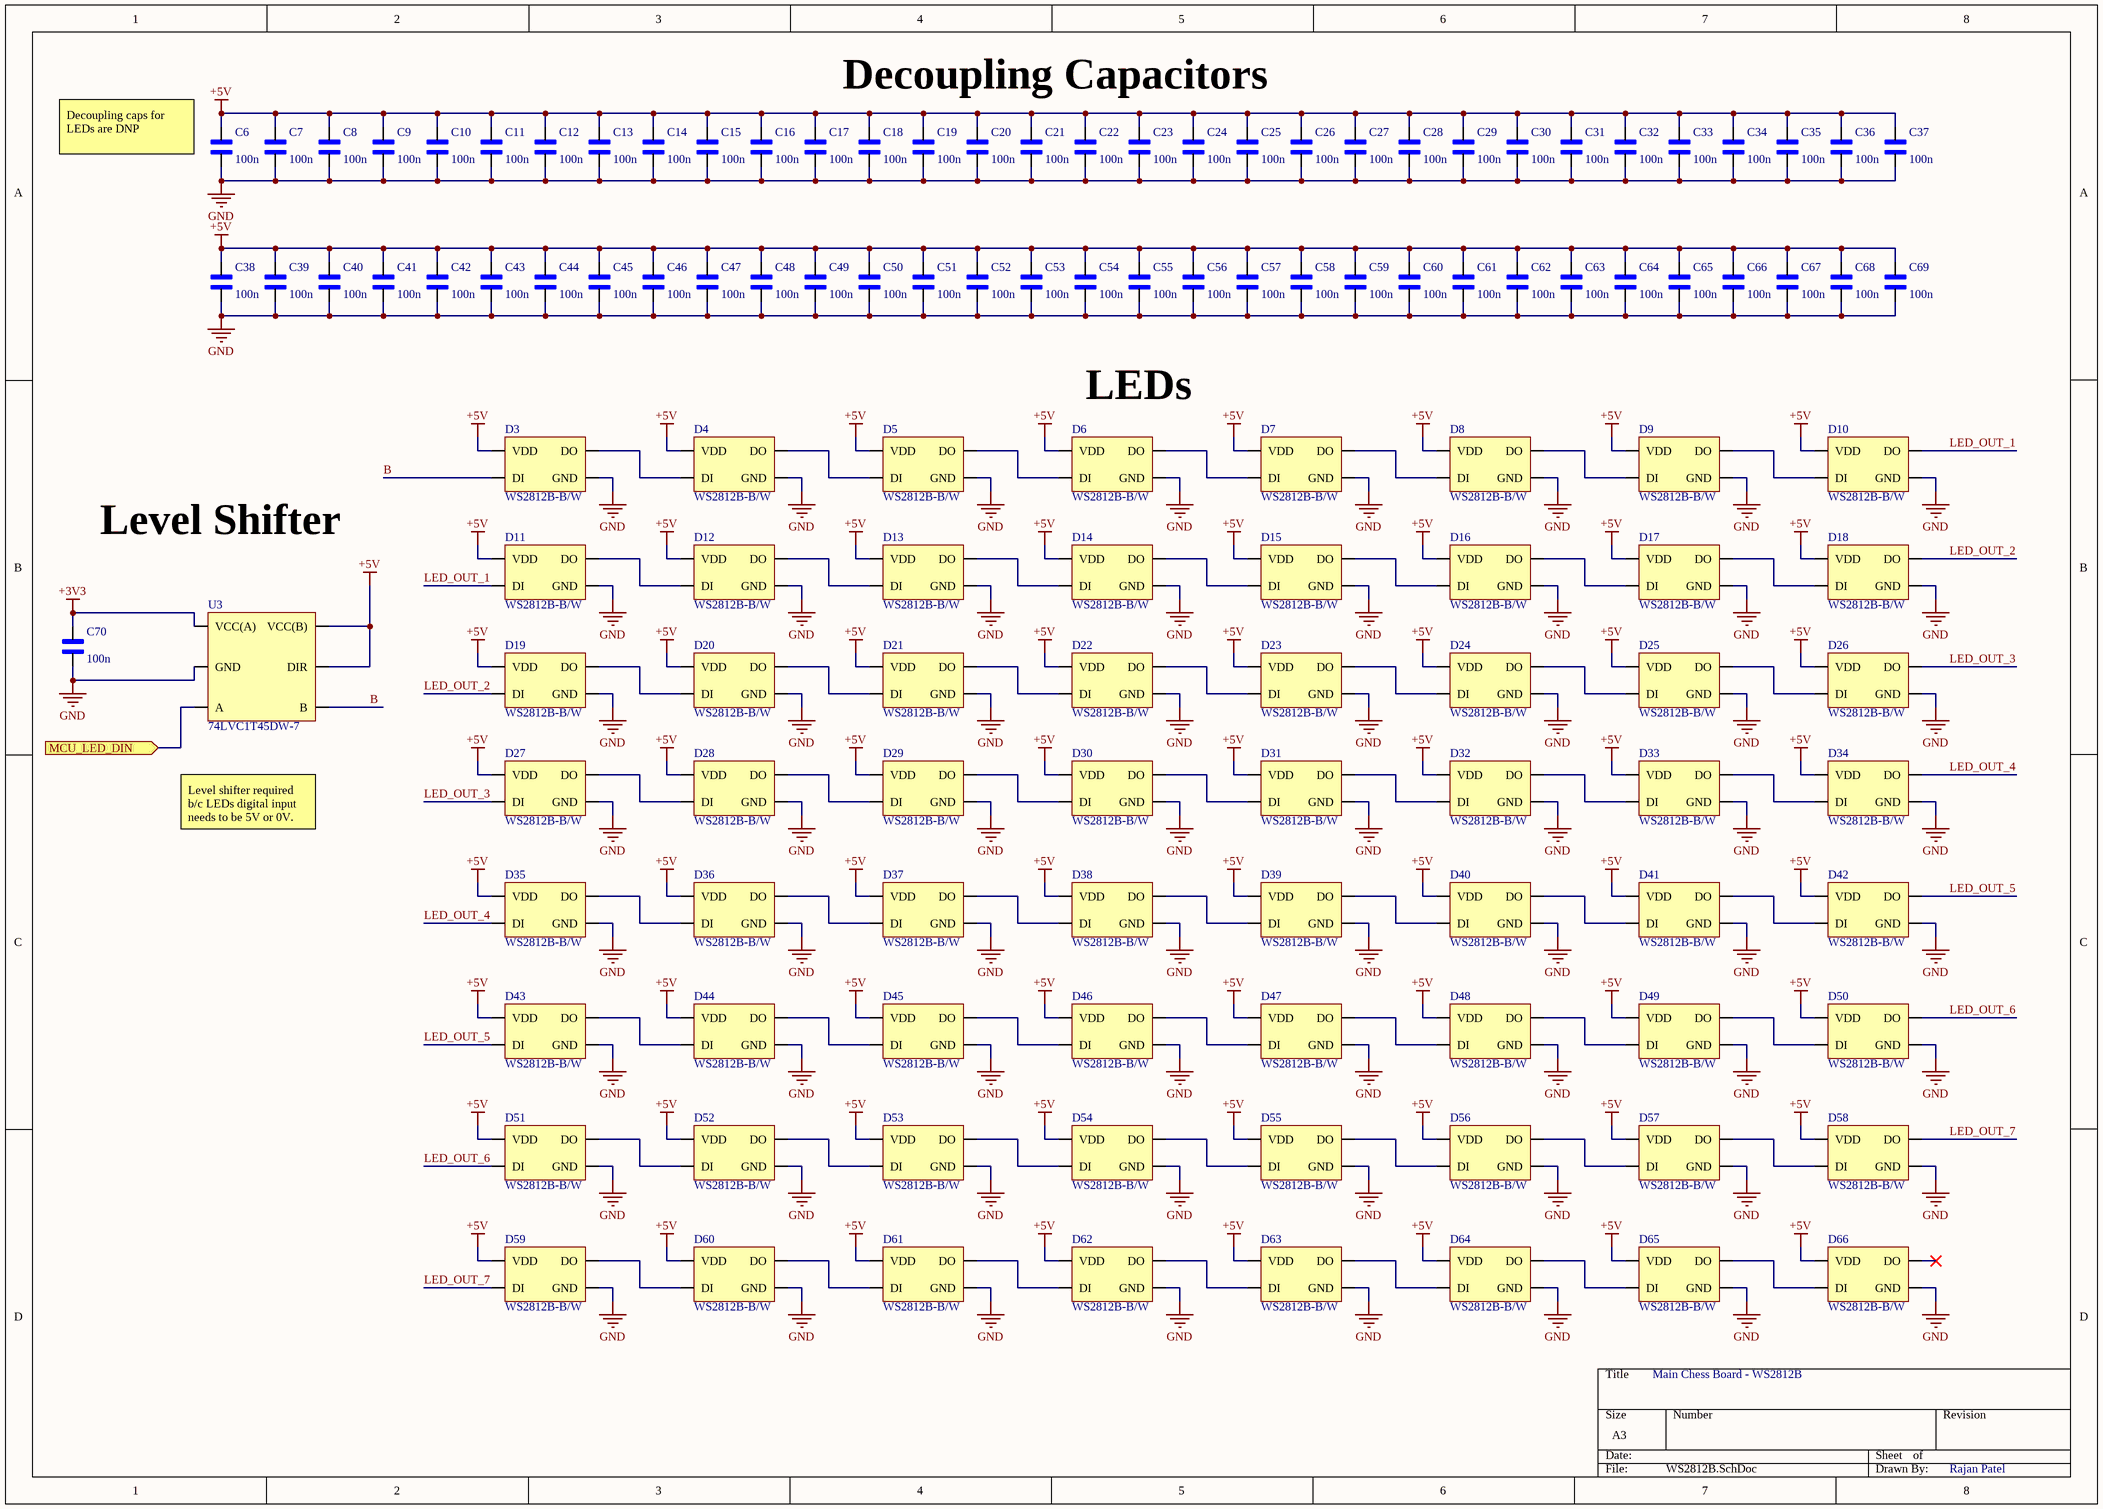
[diagram p3: WS2812B.SchDoc]

### Parts
C6  100n  [CAP 0805]
C7  100n  [CAP 0805]
C8  100n  [CAP 0805]
C9  100n  [CAP 0805]
C10  100n  [CAP 0805]
C11  100n  [CAP 0805]
C12  100n  [CAP 0805]
C13  100n  [CAP 0805]
C14  100n  [CAP 0805]
C15  100n  [CAP 0805]
C16  100n  [CAP 0805]
C17  100n  [CAP 0805]
C18  100n  [CAP 0805]
C19  100n  [CAP 0805]
C20  100n  [CAP 0805]
C21  100n  [CAP 0805]
C22  100n  [CAP 0805]
C23  100n  [CAP 0805]
C24  100n  [CAP 0805]
C25  100n  [CAP 0805]
C26  100n  [CAP 0805]
C27  100n  [CAP 0805]
C28  100n  [CAP 0805]
C29  100n  [CAP 0805]
C30  100n  [CAP 0805]
C31  100n  [CAP 0805]
C32  100n  [CAP 0805]
C33  100n  [CAP 0805]
C34  100n  [CAP 0805]
C35  100n  [CAP 0805]
C36  100n  [CAP 0805]
C37  100n  [CAP 0805]
C38  100n  [CAP 0805]
C39  100n  [CAP 0805]
C40  100n  [CAP 0805]
C41  100n  [CAP 0805]
C42  100n  [CAP 0805]
C43  100n  [CAP 0805]
C44  100n  [CAP 0805]
C45  100n  [CAP 0805]
C46  100n  [CAP 0805]
C47  100n  [CAP 0805]
C48  100n  [CAP 0805]
C49  100n  [CAP 0805]
C50  100n  [CAP 0805]
C51  100n  [CAP 0805]
C52  100n  [CAP 0805]
C53  100n  [CAP 0805]
C54  100n  [CAP 0805]
C55  100n  [CAP 0805]
C56  100n  [CAP 0805]
C57  100n  [CAP 0805]
C58  100n  [CAP 0805]
C59  100n  [CAP 0805]
C60  100n  [CAP 0805]
C61  100n  [CAP 0805]
C62  100n  [CAP 0805]
C63  100n  [CAP 0805]
C64  100n  [CAP 0805]
C65  100n  [CAP 0805]
C66  100n  [CAP 0805]
C67  100n  [CAP 0805]
C68  100n  [CAP 0805]
C69  100n  [CAP 0805]
C70  100n  [CAP 0805]
D3  WS2812B-B/W  [WS2812B-B/W]
D4  WS2812B-B/W  [WS2812B-B/W]
D5  WS2812B-B/W  [WS2812B-B/W]
D6  WS2812B-B/W  [WS2812B-B/W]
D7  WS2812B-B/W  [WS2812B-B/W]
D8  WS2812B-B/W  [WS2812B-B/W]
D9  WS2812B-B/W  [WS2812B-B/W]
D10  WS2812B-B/W  [WS2812B-B/W]
D11  WS2812B-B/W  [WS2812B-B/W]
D12  WS2812B-B/W  [WS2812B-B/W]
D13  WS2812B-B/W  [WS2812B-B/W]
D14  WS2812B-B/W  [WS2812B-B/W]
D15  WS2812B-B/W  [WS2812B-B/W]
D16  WS2812B-B/W  [WS2812B-B/W]
D17  WS2812B-B/W  [WS2812B-B/W]
D18  WS2812B-B/W  [WS2812B-B/W]
D19  WS2812B-B/W  [WS2812B-B/W]
D20  WS2812B-B/W  [WS2812B-B/W]
D21  WS2812B-B/W  [WS2812B-B/W]
D22  WS2812B-B/W  [WS2812B-B/W]
D23  WS2812B-B/W  [WS2812B-B/W]
D24  WS2812B-B/W  [WS2812B-B/W]
D25  WS2812B-B/W  [WS2812B-B/W]
D26  WS2812B-B/W  [WS2812B-B/W]
D27  WS2812B-B/W  [WS2812B-B/W]
D28  WS2812B-B/W  [WS2812B-B/W]
D29  WS2812B-B/W  [WS2812B-B/W]
D30  WS2812B-B/W  [WS2812B-B/W]
D31  WS2812B-B/W  [WS2812B-B/W]
D32  WS2812B-B/W  [WS2812B-B/W]
D33  WS2812B-B/W  [WS2812B-B/W]
D34  WS2812B-B/W  [WS2812B-B/W]
D35  WS2812B-B/W  [WS2812B-B/W]
D36  WS2812B-B/W  [WS2812B-B/W]
D37  WS2812B-B/W  [WS2812B-B/W]
D38  WS2812B-B/W  [WS2812B-B/W]
D39  WS2812B-B/W  [WS2812B-B/W]
D40  WS2812B-B/W  [WS2812B-B/W]
D41  WS2812B-B/W  [WS2812B-B/W]
D42  WS2812B-B/W  [WS2812B-B/W]
D43  WS2812B-B/W  [WS2812B-B/W]
D44  WS2812B-B/W  [WS2812B-B/W]
D45  WS2812B-B/W  [WS2812B-B/W]
D46  WS2812B-B/W  [WS2812B-B/W]
D47  WS2812B-B/W  [WS2812B-B/W]
D48  WS2812B-B/W  [WS2812B-B/W]
D49  WS2812B-B/W  [WS2812B-B/W]
D50  WS2812B-B/W  [WS2812B-B/W]
D51  WS2812B-B/W  [WS2812B-B/W]
D52  WS2812B-B/W  [WS2812B-B/W]
D53  WS2812B-B/W  [WS2812B-B/W]
D54  WS2812B-B/W  [WS2812B-B/W]
D55  WS2812B-B/W  [WS2812B-B/W]
D56  WS2812B-B/W  [WS2812B-B/W]
D57  WS2812B-B/W  [WS2812B-B/W]
D58  WS2812B-B/W  [WS2812B-B/W]
D59  WS2812B-B/W  [WS2812B-B/W]
D60  WS2812B-B/W  [WS2812B-B/W]
D61  WS2812B-B/W  [WS2812B-B/W]
D62  WS2812B-B/W  [WS2812B-B/W]
D63  WS2812B-B/W  [WS2812B-B/W]
D64  WS2812B-B/W  [WS2812B-B/W]
D65  WS2812B-B/W  [WS2812B-B/W]
D66  WS2812B-B/W  [WS2812B-B/W]
U3  74LVC1T45DW-7  [74LVC1T45DW-7]

### Ports
MCU_LED_DIN (in, see Microcontroller and Power Management[2C])

### Nets
+3V3: C70.2 U3.1(VCC(A))
+5V: C6.2 C7.2 C8.2 C9.2 C10.2 C11.2 C12.2 C13.2 C14.2 C15.2 C16.2 C17.2 C18.2 C19.2 C20.2 C21.2 C22.2 C23.2 C24.2 C25.2 C26.2 C27.2 C28.2 C29.2 C30.2 C31.2 C32.2 C33.2 C34.2 C35.2 C36.2 C37.2 C38.2 C39.2 C40.2 C41.2 C42.2 C43.2 C44.2 C45.2 C46.2 C47.2 C48.2 C49.2 C50.2 C51.2 C52.2 C53.2 C54.2 C55.2 C56.2 C57.2 C58.2 C59.2 C60.2 C61.2 C62.2 C63.2 C64.2 C65.2 C66.2 C67.2 C68.2 C69.2 D3.1(VDD) D4.1(VDD) D5.1(VDD) D6.1(VDD) D7.1(VDD) D8.1(VDD) D9.1(VDD) D10.1(VDD) D11.1(VDD) D12.1(VDD) D13.1(VDD) D14.1(VDD) D15.1(VDD) D16.1(VDD) D17.1(VDD) D18.1(VDD) D19.1(VDD) D20.1(VDD) D21.1(VDD) D22.1(VDD) D23.1(VDD) D24.1(VDD) D25.1(VDD) D26.1(VDD) D27.1(VDD) D28.1(VDD) D29.1(VDD) D30.1(VDD) D31.1(VDD) D32.1(VDD) D33.1(VDD) D34.1(VDD) D35.1(VDD) D36.1(VDD) D37.1(VDD) D38.1(VDD) D39.1(VDD) D40.1(VDD) D41.1(VDD) D42.1(VDD) D43.1(VDD) D44.1(VDD) D45.1(VDD) D46.1(VDD) D47.1(VDD) D48.1(VDD) D49.1(VDD) D50.1(VDD) D51.1(VDD) D52.1(VDD) D53.1(VDD) D54.1(VDD) D55.1(VDD) D56.1(VDD) D57.1(VDD) D58.1(VDD) D59.1(VDD) D60.1(VDD) D61.1(VDD) D62.1(VDD) D63.1(VDD) D64.1(VDD) D65.1(VDD) D66.1(VDD) U3.5(DIR) U3.6(VCC(B))
GND: C6.1 C7.1 C8.1 C9.1 C10.1 C11.1 C12.1 C13.1 C14.1 C15.1 C16.1 C17.1 C18.1 C19.1 C20.1 C21.1 C22.1 C23.1 C24.1 C25.1 C26.1 C27.1 C28.1 C29.1 C30.1 C31.1 C32.1 C33.1 C34.1 C35.1 C36.1 C37.1 C38.1 C39.1 C40.1 C41.1 C42.1 C43.1 C44.1 C45.1 C46.1 C47.1 C48.1 C49.1 C50.1 C51.1 C52.1 C53.1 C54.1 C55.1 C56.1 C57.1 C58.1 C59.1 C60.1 C61.1 C62.1 C63.1 C64.1 C65.1 C66.1 C67.1 C68.1 C69.1 C70.1 D3.4(GND) D4.4(GND) D5.4(GND) D6.4(GND) D7.4(GND) D8.4(GND) D9.4(GND) D10.4(GND) D11.4(GND) D12.4(GND) D13.4(GND) D14.4(GND) D15.4(GND) D16.4(GND) D17.4(GND) D18.4(GND) D19.4(GND) D20.4(GND) D21.4(GND) D22.4(GND) D23.4(GND) D24.4(GND) D25.4(GND) D26.4(GND) D27.4(GND) D28.4(GND) D29.4(GND) D30.4(GND) D31.4(GND) D32.4(GND) D33.4(GND) D34.4(GND) D35.4(GND) D36.4(GND) D37.4(GND) D38.4(GND) D39.4(GND) D40.4(GND) D41.4(GND) D42.4(GND) D43.4(GND) D44.4(GND) D45.4(GND) D46.4(GND) D47.4(GND) D48.4(GND) D49.4(GND) D50.4(GND) D51.4(GND) D52.4(GND) D53.4(GND) D54.4(GND) D55.4(GND) D56.4(GND) D57.4(GND) D58.4(GND) D59.4(GND) D60.4(GND) D61.4(GND) D62.4(GND) D63.4(GND) D64.4(GND) D65.4(GND) D66.4(GND) U3.2(GND)
B: D3.2(DI) U3.4(B)
LED_OUT_1: D10.3(DO) D11.2(DI)
LED_OUT_2: D18.3(DO) D19.2(DI)
LED_OUT_3: D26.3(DO) D27.2(DI)
LED_OUT_4: D34.3(DO) D35.2(DI)
LED_OUT_5: D42.3(DO) D43.2(DI)
LED_OUT_6: D50.3(DO) D51.2(DI)
LED_OUT_7: D58.3(DO) D59.2(DI)
NetD3_3: D3.3(DO) D4.2(DI)
NetD4_3: D4.3(DO) D5.2(DI)
NetD5_3: D5.3(DO) D6.2(DI)
NetD6_3: D6.3(DO) D7.2(DI)
NetD7_3: D7.3(DO) D8.2(DI)
NetD8_3: D8.3(DO) D9.2(DI)
NetD9_3: D9.3(DO) D10.2(DI)
NetD11_3: D11.3(DO) D12.2(DI)
NetD12_3: D12.3(DO) D13.2(DI)
NetD13_3: D13.3(DO) D14.2(DI)
NetD14_3: D14.3(DO) D15.2(DI)
NetD15_3: D15.3(DO) D16.2(DI)
NetD16_3: D16.3(DO) D17.2(DI)
NetD17_3: D17.3(DO) D18.2(DI)
NetD19_3: D19.3(DO) D20.2(DI)
NetD20_3: D20.3(DO) D21.2(DI)
NetD21_3: D21.3(DO) D22.2(DI)
NetD22_3: D22.3(DO) D23.2(DI)
NetD23_3: D23.3(DO) D24.2(DI)
NetD24_3: D24.3(DO) D25.2(DI)
NetD25_3: D25.3(DO) D26.2(DI)
NetD27_3: D27.3(DO) D28.2(DI)
NetD28_3: D28.3(DO) D29.2(DI)
NetD29_3: D29.3(DO) D30.2(DI)
NetD30_3: D30.3(DO) D31.2(DI)
NetD31_3: D31.3(DO) D32.2(DI)
NetD32_3: D32.3(DO) D33.2(DI)
NetD33_3: D33.3(DO) D34.2(DI)
NetD35_3: D35.3(DO) D36.2(DI)
NetD36_3: D36.3(DO) D37.2(DI)
NetD37_3: D37.3(DO) D38.2(DI)
NetD38_3: D38.3(DO) D39.2(DI)
NetD39_3: D39.3(DO) D40.2(DI)
NetD40_3: D40.3(DO) D41.2(DI)
NetD41_3: D41.3(DO) D42.2(DI)
NetD43_3: D43.3(DO) D44.2(DI)
NetD44_3: D44.3(DO) D45.2(DI)
NetD45_3: D45.3(DO) D46.2(DI)
NetD46_3: D46.3(DO) D47.2(DI)
NetD47_3: D47.3(DO) D48.2(DI)
NetD48_3: D48.3(DO) D49.2(DI)
NetD49_3: D49.3(DO) D50.2(DI)
NetD51_3: D51.3(DO) D52.2(DI)
NetD52_3: D52.3(DO) D53.2(DI)
NetD53_3: D53.3(DO) D54.2(DI)
NetD54_3: D54.3(DO) D55.2(DI)
NetD55_3: D55.3(DO) D56.2(DI)
NetD56_3: D56.3(DO) D57.2(DI)
NetD57_3: D57.3(DO) D58.2(DI)
NetD59_3: D59.3(DO) D60.2(DI)
NetD60_3: D60.3(DO) D61.2(DI)
NetD61_3: D61.3(DO) D62.2(DI)
NetD62_3: D62.3(DO) D63.2(DI)
NetD63_3: D63.3(DO) D64.2(DI)
NetD64_3: D64.3(DO) D65.2(DI)
NetD65_3: D65.3(DO) D66.2(DI)
NetU2_7: U3.3(A) ; port MCU_LED_DIN

Not connected (* = marked no-connect by the designer): D66 3(DO)*

### Notes on the sheet
- Decoupling Capacitors
- (near C6) Decoupling caps for LEDs are DNP
- (near D6) LEDs
- Level Shifter
- Level shifter required b/c LEDs digital input needs to be 5V or 0V.
- Main Chess Board - WS2812B
- Rajan Patel

### Library data of the parts
C6-C70 = CAP 0805: SnapEDA_Link: https://www.snapeda.com/parts/C2012X8R1H104K125AA/TDK/view-part/?ref=snap; Check_prices: https://www.snapeda.com/parts/C2012X8R1H104K125AA/TDK/view-part/?ref=eda; Value: *
D3-D66 = WS2812B-B/W: SMD5050 RGB LEDs(Built-in IC) ROHS; Manufacturer: Worldsemi; Supplier: LCSC; Supplier Part Number: C114586; Manufacturer Part Number: WS2812B-B/W
U3 = 74LVC1T45DW-7: Bus Transceiver, LVC/LCX/Z Series, 1-Func, 1-Bit, True Output, CMOS, PDSO6; Manufacturer: Diodes; Package Body Material: Plastic; Control Type: COMMON CONTROL; Count Direction: Bidirectional; Load/Preset Input: Yes; Max I(ol): 24mA; Number of Bits: 1; Number of Ports: 2; Output Characteristics: 3-STATE; Package Equivalence Code: TSSOP6,.08; Power Supplies: 3.3V; Max Supply Voltage: 5.5V; Min Supply Voltage: 1.65V; Qualification Status: Not Qualified; Supplier: Future Electronics; Supplier Part Number: 3070442; Manufacturer Part Number: 74LVC1T45DW-7; RoHS: Yes; Stock: 42000; Pricing: 3000=0.0512, 9000=0.0494, 15000=0.0485, 60000=0.0463, 90000=0.0449 (USD); Case/Package: TSSOP; Pins: 6; Package Shape: Rectangular; Terminal Finish: Tin; Min Operating Temperature: -40°C; Max Operating Temperature: 125°C; JESD-609 Code: e3; Output Polarity: True; JESD-30 Code: R-PDSO-G6; Logic Type: BUS TRANSCEIVER; Moisture Sensitivity Level: 1; Channels: 1; Package Style: SMALL OUTLINE, THIN PROFILE, SHRINK PITCHMeter; Packaging: Tape and Reel; Nominal Supply Voltage: 3.3V; Surface Mount: Yes; Technology: CMOS; Terminal Form: Gull Wing; Terminal Position: DUAL; Length: 2mm; Width: 1.25mm; Height - Seated (Max): 1.1mm; Terminal Pitch: 0.65mm; Temperature Grade: AUTOMOTIVE; Reach SVHC Compliant: Yes; RoHS Compliant: Yes; ComponentLink1URL: https://datasheet.ciiva.com:443/pdfs/VipMasterIC/IC/DIOD/DIOD-S-A0006644025/DIOD-S-A0006644025-1.pdf?src-supplier=IHS+Markit; ComponentLink1Description: https://datasheet.ciiva.com:443/pdfs/VipMasterIC/IC/DIOD/DIOD-S-A0006644025/DIOD-S-A0006644025-1.pdf?src-supplier=IHS+Markit; ComponentLink2URL: http://www.mouser.com/ds/2/115/74LVC1T45-318124.pdf?src-supplier=Mouser; ComponentLink2Description: http://www.mouser.com/ds/2/115/74LVC1T45-318124.pdf?src-supplier=Mouser; ComponentLink3URL: https://www.diodes.com/assets/Datasheets/74LVC1T45.pdf?src-supplier=Digikey; ComponentLink3Description: https://www.diodes.com/assets/Datasheets/74LVC1T45.pdf?src-supplier=Digikey; ComponentLink4URL: https://datasheet.octopart.com/74LVC1T45DW-7-Diodes-Inc.-datasheet-160640065.pdf?src-supplier=Newark; ComponentLink4Description: https://datasheet.octopart.com/74LVC1T45DW-7-Diodes-Inc.-datasheet-160640065.pdf?src-supplier=Newark; ComponentLink5URL: http://www.diodes.com/datasheets/74LVC1T45.pdf?src-supplier=Avnet; ComponentLink5Description: http://www.diodes.com/datasheets/74LVC1T45.pdf?src-supplier=Avnet

## Sheet Shift Registers.SchDoc
size A4; SheetNumber: 4; SheetTotal: 4
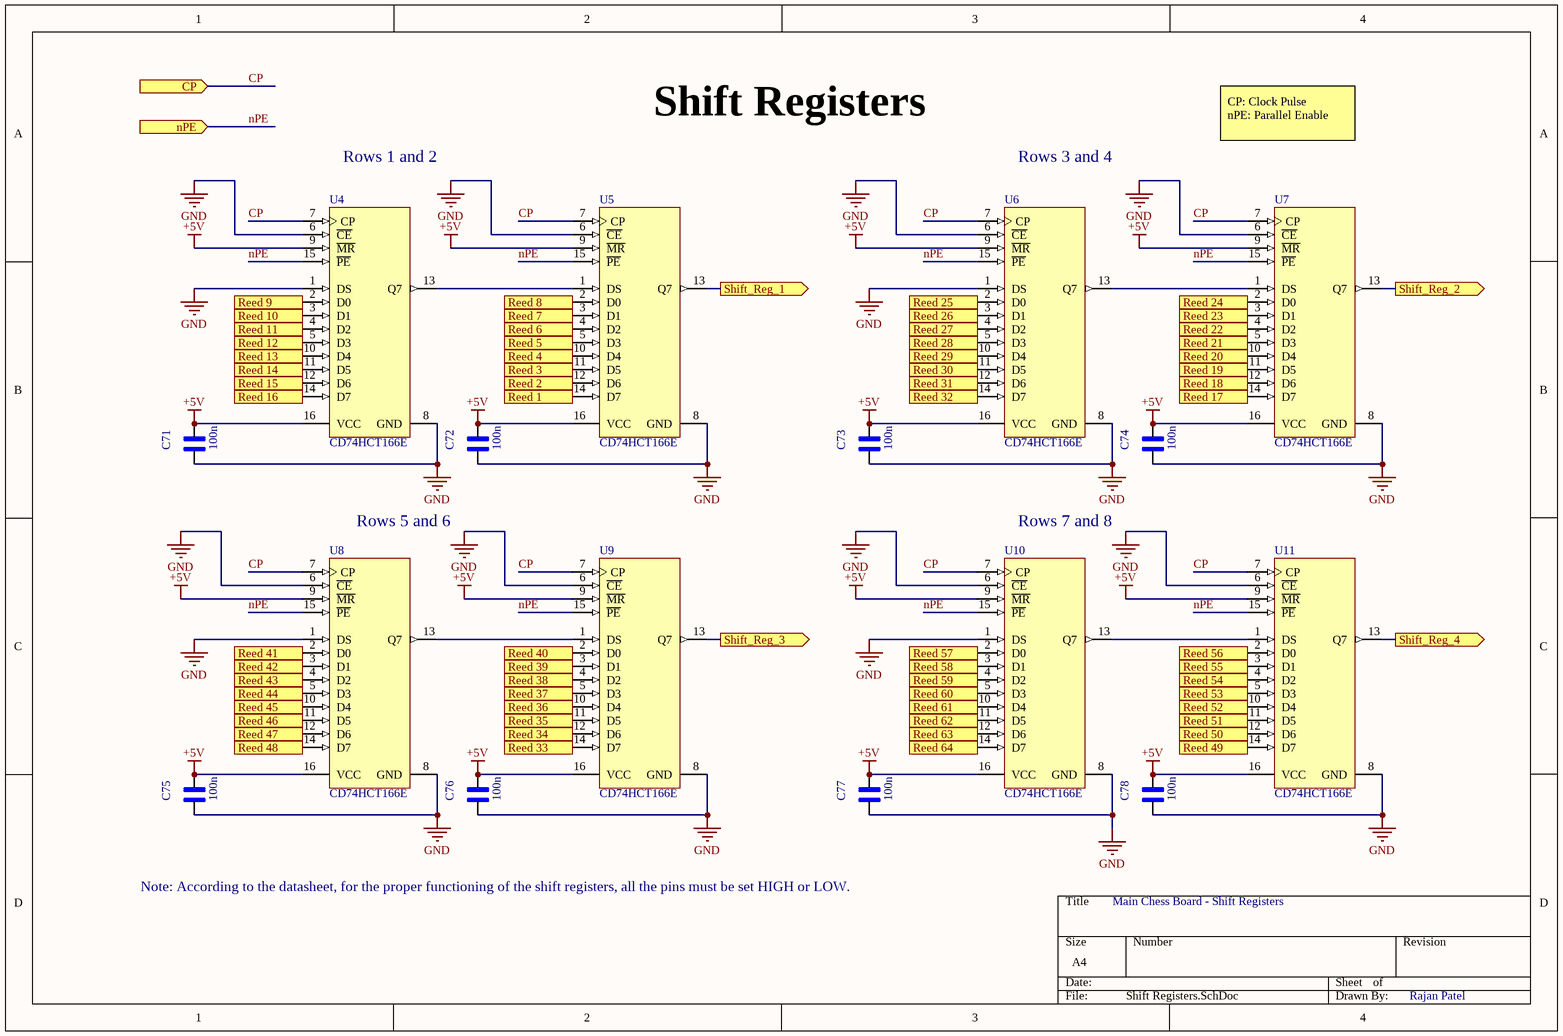
[diagram p4: Shift Registers.SchDoc]

### Parts
C71  100n  [CAP 0805]
C72  100n  [CAP 0805]
C73  100n  [CAP 0805]
C74  100n  [CAP 0805]
C75  100n  [CAP 0805]
C76  100n  [CAP 0805]
C77  100n  [CAP 0805]
C78  100n  [CAP 0805]
U4  CD74HCT166E  [N0016A]
U5  CD74HCT166E  [N0016A]
U6  CD74HCT166E  [N0016A]
U7  CD74HCT166E  [N0016A]
U8  CD74HCT166E  [N0016A]
U9  CD74HCT166E  [N0016A]
U10  CD74HCT166E  [N0016A]
U11  CD74HCT166E  [N0016A]

### Ports
CP (in, see Microcontroller and Power Management[2D]), nPE (in, see Microcontroller and Power Management[2D]), Reed 1 (in, see Reed Switches[1A]), Reed 2 (in, see Reed Switches[2A]), Reed 3 (in, see Reed Switches[3A]), Reed 4 (in, see Reed Switches[4A]), Reed 5 (in, see Reed Switches[5A]), Reed 6 (in, see Reed Switches[6A]), Reed 7 (in, see Reed Switches[6A]), Reed 8 (in, see Reed Switches[7A]), Reed 9 (in, see Reed Switches[1A]), Reed 10 (in, see Reed Switches[2A]), Reed 11 (in, see Reed Switches[3A]), Reed 12 (in, see Reed Switches[4A]), Reed 13 (in, see Reed Switches[5A]), Reed 14 (in, see Reed Switches[6A]), Reed 15 (in, see Reed Switches[6A]), Reed 16 (in, see Reed Switches[7A]), Reed 17 (in, see Reed Switches[1B]), Reed 18 (in, see Reed Switches[2B]), Reed 19 (in, see Reed Switches[3B]), Reed 20 (in, see Reed Switches[4B]), Reed 21 (in, see Reed Switches[5B]), Reed 22 (in, see Reed Switches[6B]), Reed 23 (in, see Reed Switches[6B]), Reed 24 (in, see Reed Switches[7B]), Reed 25 (in, see Reed Switches[1B]), Reed 26 (in, see Reed Switches[2B]), Reed 27 (in, see Reed Switches[3B]), Reed 28 (in, see Reed Switches[4B]), Reed 29 (in, see Reed Switches[5B]), Reed 30 (in, see Reed Switches[6B]), Reed 31 (in, see Reed Switches[6B]), Reed 32 (in, see Reed Switches[7B]), Reed 33 (in, see Reed Switches[1C]), Reed 34 (in, see Reed Switches[2C]), Reed 35 (in, see Reed Switches[3C]), Reed 36 (in, see Reed Switches[4C]), Reed 37 (in, see Reed Switches[5C]), Reed 38 (in, see Reed Switches[6C]), Reed 39 (in, see Reed Switches[6C]), Reed 40 (in, see Reed Switches[7C]), Reed 41 (in, see Reed Switches[1C]), Reed 42 (in, see Reed Switches[2C]), Reed 43 (in, see Reed Switches[3C]), Reed 44 (in, see Reed Switches[4C]), Reed 45 (in, see Reed Switches[5C]), Reed 46 (in, see Reed Switches[6C]), Reed 47 (in, see Reed Switches[6C]), Reed 48 (in, see Reed Switches[7C]), Reed 49 (in, see Reed Switches[1C]), Reed 50 (in, see Reed Switches[2C]), Reed 51 (in, see Reed Switches[3C]), Reed 52 (in, see Reed Switches[4C]), Reed 53 (in, see Reed Switches[5C]), Reed 54 (in, see Reed Switches[6C]), Reed 55 (in, see Reed Switches[6C]), Reed 56 (in, see Reed Switches[7C]), Reed 57 (in, see Reed Switches[1D]), Reed 58 (in, see Reed Switches[2D]), Reed 59 (in, see Reed Switches[3D]), Reed 60 (in, see Reed Switches[4D]), Reed 61 (in, see Reed Switches[5D]), Reed 62 (in, see Reed Switches[6D]), Reed 63 (in, see Reed Switches[6D]), Reed 64 (in, see Reed Switches[7D]), Shift_Reg_1 (out, see Microcontroller and Power Management[2D]), Shift_Reg_2 (out, see Microcontroller and Power Management[2C]), Shift_Reg_3 (out, see Microcontroller and Power Management[2D]), Shift_Reg_4 (out, see Microcontroller and Power Management[2D])

### Nets
+5V: C71.2 C72.2 C73.2 C74.2 C75.2 C76.2 C77.2 C78.2 U4.9(~{MR}) U4.16(VCC) U5.9(~{MR}) U5.16(VCC) U6.9(~{MR}) U6.16(VCC) U7.9(~{MR}) U7.16(VCC) U8.9(~{MR}) U8.16(VCC) U9.9(~{MR}) U9.16(VCC) U10.9(~{MR}) U10.16(VCC) U11.9(~{MR}) U11.16(VCC)
GND: C71.1 C72.1 C73.1 C74.1 C75.1 C76.1 C77.1 C78.1 U4.1(DS) U4.6(~{CE}) U4.8(GND) U5.6(~{CE}) U5.8(GND) U6.1(DS) U6.6(~{CE}) U6.8(GND) U7.6(~{CE}) U7.8(GND) U8.1(DS) U8.6(~{CE}) U8.8(GND) U9.6(~{CE}) U9.8(GND) U10.1(DS) U10.6(~{CE}) U10.8(GND) U11.6(~{CE}) U11.8(GND)
CP: U4.7(CP) U5.7(CP) U6.7(CP) U7.7(CP) U8.7(CP) U9.7(CP) U10.7(CP) U11.7(CP) ; port CP
nPE: U4.15(~{PE}) U5.15(~{PE}) U6.15(~{PE}) U7.15(~{PE}) U8.15(~{PE}) U9.15(~{PE}) U10.15(~{PE}) U11.15(~{PE}) ; port nPE
NetR6_2: U5.14(D7) ; port Reed 1
NetR7_2: U5.12(D6) ; port Reed 2
NetR8_2: U5.11(D5) ; port Reed 3
NetR9_2: U5.5(D3) ; port Reed 5
NetR10_2: U5.10(D4) ; port Reed 4
NetR11_2: U5.4(D2) ; port Reed 6
NetR12_2: U5.3(D1) ; port Reed 7
NetR13_2: U5.2(D0) ; port Reed 8
NetR14_2: U4.2(D0) ; port Reed 9
NetR15_2: U4.3(D1) ; port Reed 10
NetR16_2: U4.4(D2) ; port Reed 11
NetR17_2: U4.10(D4) ; port Reed 13
NetR18_2: U4.5(D3) ; port Reed 12
NetR19_2: U4.11(D5) ; port Reed 14
NetR20_2: U4.12(D6) ; port Reed 15
NetR21_2: U4.14(D7) ; port Reed 16
NetR22_2: U7.14(D7) ; port Reed 17
NetR23_2: U7.12(D6) ; port Reed 18
NetR24_2: U7.11(D5) ; port Reed 19
NetR25_2: U7.5(D3) ; port Reed 21
NetR26_2: U7.10(D4) ; port Reed 20
NetR27_2: U7.4(D2) ; port Reed 22
NetR28_2: U7.3(D1) ; port Reed 23
NetR29_2: U7.2(D0) ; port Reed 24
NetR30_2: U6.2(D0) ; port Reed 25
NetR31_2: U6.3(D1) ; port Reed 26
NetR32_2: U6.4(D2) ; port Reed 27
NetR33_2: U6.10(D4) ; port Reed 29
NetR34_2: U6.5(D3) ; port Reed 28
NetR35_2: U6.11(D5) ; port Reed 30
NetR36_2: U6.12(D6) ; port Reed 31
NetR37_2: U6.14(D7) ; port Reed 32
NetR38_2: U9.14(D7) ; port Reed 33
NetR39_2: U9.12(D6) ; port Reed 34
NetR40_2: U9.11(D5) ; port Reed 35
NetR41_2: U9.5(D3) ; port Reed 37
NetR42_2: U9.10(D4) ; port Reed 36
NetR43_2: U9.4(D2) ; port Reed 38
NetR44_2: U9.3(D1) ; port Reed 39
NetR45_2: U9.2(D0) ; port Reed 40
NetR46_2: U8.2(D0) ; port Reed 41
NetR47_2: U8.3(D1) ; port Reed 42
NetR48_2: U8.4(D2) ; port Reed 43
NetR49_2: U8.10(D4) ; port Reed 45
NetR50_2: U8.5(D3) ; port Reed 44
NetR51_2: U8.11(D5) ; port Reed 46
NetR52_2: U8.12(D6) ; port Reed 47
NetR53_2: U8.14(D7) ; port Reed 48
NetR54_2: U11.14(D7) ; port Reed 49
NetR55_2: U11.12(D6) ; port Reed 50
NetR56_2: U11.11(D5) ; port Reed 51
NetR57_2: U11.5(D3) ; port Reed 53
NetR58_2: U11.10(D4) ; port Reed 52
NetR59_2: U11.4(D2) ; port Reed 54
NetR60_2: U11.3(D1) ; port Reed 55
NetR61_2: U11.2(D0) ; port Reed 56
NetR62_2: U10.2(D0) ; port Reed 57
NetR63_2: U10.3(D1) ; port Reed 58
NetR64_2: U10.4(D2) ; port Reed 59
NetR65_2: U10.10(D4) ; port Reed 61
NetR66_2: U10.5(D3) ; port Reed 60
NetR67_2: U10.11(D5) ; port Reed 62
NetR68_2: U10.12(D6) ; port Reed 63
NetR69_2: U10.14(D7) ; port Reed 64
NetU2_8: U11.13(Q7) ; port Shift_Reg_4
NetU2_9: U9.13(Q7) ; port Shift_Reg_3
NetU2_10: U7.13(Q7) ; port Shift_Reg_2
NetU2_15: U5.13(Q7) ; port Shift_Reg_1
NetU4_13: U4.13(Q7) U5.1(DS)
NetU6_13: U6.13(Q7) U7.1(DS)
NetU8_13: U8.13(Q7) U9.1(DS)
NetU10_13: U10.13(Q7) U11.1(DS)

### Notes on the sheet
- Rows 1 and 2
- Shift Registers
- Rows 3 and 4
- CP: Clock Pulse
  nPE: Parallel Enable
- (near U8) Rows 5 and 6
- (near U10) Rows 7 and 8
- Note: According to the datasheet, for the proper functioning of the shift registers, all the pins must be set HIGH or LOW.
- Main Chess Board - Shift Registers
- Rajan Patel

### Library data of the parts
C71-C78 = CAP 0805: SnapEDA_Link: https://www.snapeda.com/parts/C2012X8R1H104K125AA/TDK/view-part/?ref=snap; Check_prices: https://www.snapeda.com/parts/C2012X8R1H104K125AA/TDK/view-part/?ref=eda; Value: *
U4-U11 = CMP-0807-00166-3: High Speed CMOS Logic 8-Bit Parallel-In/Serial-Out Shift Register, N0016A, TUBE; Manufacturer: Texas Instruments; Voltage(Nom)(V): 5; Bits: 8; Output Drive (IOL/IOH)(Max)(mA): 4/-4; F @ Nom Voltage(Max)(Mhz): 25; VCC(Max)(V): 5.5; 3-State Output: No; VCC(Min)(V): 4.5; tpd @ Nom Voltage(Max)(ns): 50; Technology Family: HCT; Input Type: TTL; ICC @ Nom Voltage(Max)(mA): 0.08; Rating: Catalog; Operating Temperature Range(C): -55 to 125; PackageVersion: http://www.ti.com/lit/ml/mpdi002c/mpdi002c.pdf; DatasheetVersion: SCHS157C; Generic Part Number: CD74HCT166; PackageReference: N0016A; Code_JEDEC: MS-001; Output Type: CMOS

## Nets that join several sheets
+3V3: Microcontroller and Power Management (6 pins), Reed Switches (64 pins), WS2812B (C70.2 U3.1)
+5V: Microcontroller and Power Management (8 pins), WS2812B (130 pins), Shift Registers (24 pins)
GND: Microcontroller and Power Management (19 pins), Reed Switches (64 pins), WS2812B (130 pins), Shift Registers (28 pins)
CP: Microcontroller and Power Management (U2.12), Shift Registers (8 pins)
NetR6_2: Reed Switches (R6.2 SW2.1), Shift Registers (U5.14)
NetR7_2: Reed Switches (R7.2 SW3.1), Shift Registers (U5.12)
NetR8_2: Reed Switches (R8.2 SW4.1), Shift Registers (U5.11)
NetR9_2: Reed Switches (R9.2 SW5.1), Shift Registers (U5.5)
NetR10_2: Reed Switches (R10.2 SW6.1), Shift Registers (U5.10)
NetR11_2: Reed Switches (R11.2 SW7.1), Shift Registers (U5.4)
NetR12_2: Reed Switches (R12.2 SW8.1), Shift Registers (U5.3)
NetR13_2: Reed Switches (R13.2 SW9.1), Shift Registers (U5.2)
NetR14_2: Reed Switches (R14.2 SW10.1), Shift Registers (U4.2)
NetR15_2: Reed Switches (R15.2 SW11.1), Shift Registers (U4.3)
NetR16_2: Reed Switches (R16.2 SW12.1), Shift Registers (U4.4)
NetR17_2: Reed Switches (R17.2 SW13.1), Shift Registers (U4.10)
NetR18_2: Reed Switches (R18.2 SW14.1), Shift Registers (U4.5)
NetR19_2: Reed Switches (R19.2 SW15.1), Shift Registers (U4.11)
NetR20_2: Reed Switches (R20.2 SW16.1), Shift Registers (U4.12)
NetR21_2: Reed Switches (R21.2 SW17.1), Shift Registers (U4.14)
NetR22_2: Reed Switches (R22.2 SW18.1), Shift Registers (U7.14)
NetR23_2: Reed Switches (R23.2 SW19.1), Shift Registers (U7.12)
NetR24_2: Reed Switches (R24.2 SW20.1), Shift Registers (U7.11)
NetR25_2: Reed Switches (R25.2 SW21.1), Shift Registers (U7.5)
NetR26_2: Reed Switches (R26.2 SW22.1), Shift Registers (U7.10)
NetR27_2: Reed Switches (R27.2 SW23.1), Shift Registers (U7.4)
NetR28_2: Reed Switches (R28.2 SW24.1), Shift Registers (U7.3)
NetR29_2: Reed Switches (R29.2 SW25.1), Shift Registers (U7.2)
NetR30_2: Reed Switches (R30.2 SW26.1), Shift Registers (U6.2)
NetR31_2: Reed Switches (R31.2 SW27.1), Shift Registers (U6.3)
NetR32_2: Reed Switches (R32.2 SW28.1), Shift Registers (U6.4)
NetR33_2: Reed Switches (R33.2 SW29.1), Shift Registers (U6.10)
NetR34_2: Reed Switches (R34.2 SW30.1), Shift Registers (U6.5)
NetR35_2: Reed Switches (R35.2 SW31.1), Shift Registers (U6.11)
NetR36_2: Reed Switches (R36.2 SW32.1), Shift Registers (U6.12)
NetR37_2: Reed Switches (R37.2 SW33.1), Shift Registers (U6.14)
NetR38_2: Reed Switches (R38.2 SW34.1), Shift Registers (U9.14)
NetR39_2: Reed Switches (R39.2 SW35.1), Shift Registers (U9.12)
NetR40_2: Reed Switches (R40.2 SW36.1), Shift Registers (U9.11)
NetR41_2: Reed Switches (R41.2 SW37.1), Shift Registers (U9.5)
NetR42_2: Reed Switches (R42.2 SW38.1), Shift Registers (U9.10)
NetR43_2: Reed Switches (R43.2 SW39.1), Shift Registers (U9.4)
NetR44_2: Reed Switches (R44.2 SW40.1), Shift Registers (U9.3)
NetR45_2: Reed Switches (R45.2 SW41.1), Shift Registers (U9.2)
NetR46_2: Reed Switches (R46.2 SW42.1), Shift Registers (U8.2)
NetR47_2: Reed Switches (R47.2 SW43.1), Shift Registers (U8.3)
NetR48_2: Reed Switches (R48.2 SW44.1), Shift Registers (U8.4)
NetR49_2: Reed Switches (R49.2 SW45.1), Shift Registers (U8.10)
NetR50_2: Reed Switches (R50.2 SW46.1), Shift Registers (U8.5)
NetR51_2: Reed Switches (R51.2 SW47.1), Shift Registers (U8.11)
NetR52_2: Reed Switches (R52.2 SW48.1), Shift Registers (U8.12)
NetR53_2: Reed Switches (R53.2 SW49.1), Shift Registers (U8.14)
NetR54_2: Reed Switches (R54.2 SW50.1), Shift Registers (U11.14)
NetR55_2: Reed Switches (R55.2 SW51.1), Shift Registers (U11.12)
NetR56_2: Reed Switches (R56.2 SW52.1), Shift Registers (U11.11)
NetR57_2: Reed Switches (R57.2 SW53.1), Shift Registers (U11.5)
NetR58_2: Reed Switches (R58.2 SW54.1), Shift Registers (U11.10)
NetR59_2: Reed Switches (R59.2 SW55.1), Shift Registers (U11.4)
NetR60_2: Reed Switches (R60.2 SW56.1), Shift Registers (U11.3)
NetR61_2: Reed Switches (R61.2 SW57.1), Shift Registers (U11.2)
NetR62_2: Reed Switches (R62.2 SW58.1), Shift Registers (U10.2)
NetR63_2: Reed Switches (R63.2 SW59.1), Shift Registers (U10.3)
NetR64_2: Reed Switches (R64.2 SW60.1), Shift Registers (U10.4)
NetR65_2: Reed Switches (R65.2 SW61.1), Shift Registers (U10.10)
NetR66_2: Reed Switches (R66.2 SW62.1), Shift Registers (U10.5)
NetR67_2: Reed Switches (R67.2 SW63.1), Shift Registers (U10.11)
NetR68_2: Reed Switches (R68.2 SW64.1), Shift Registers (U10.12)
NetR69_2: Reed Switches (R69.2 SW65.1), Shift Registers (U10.14)
NetU2_7: Microcontroller and Power Management (U2.7), WS2812B (U3.3)
NetU2_8: Microcontroller and Power Management (U2.8), Shift Registers (U11.13)
NetU2_9: Microcontroller and Power Management (U2.9), Shift Registers (U9.13)
NetU2_10: Microcontroller and Power Management (U2.10), Shift Registers (U7.13)
NetU2_15: Microcontroller and Power Management (U2.15), Shift Registers (U5.13)
nPE: Microcontroller and Power Management (U2.13), Shift Registers (8 pins)